# Altium project radxa_cm3_io_board_v1360_schematic.PrjPcb (part 1 of 5)
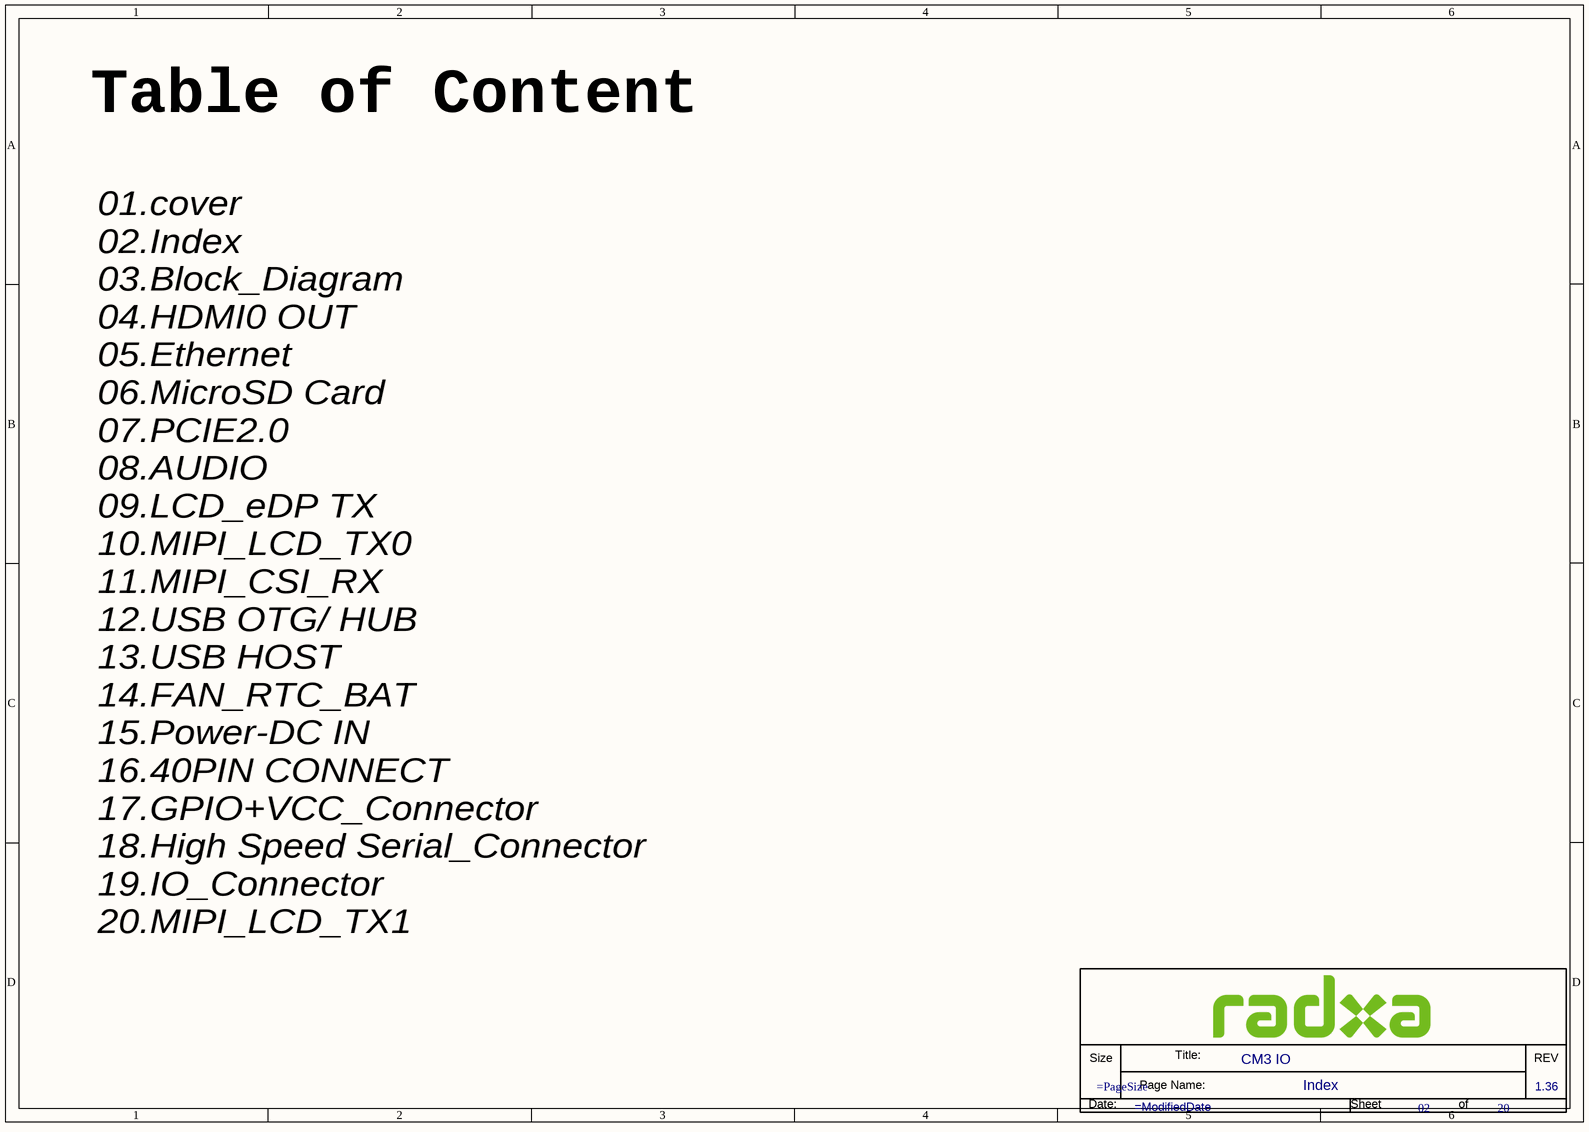
[diagram p0: 02.Index.SchDoc]
20 sheets, 532 parts. Net scope: global (net labels, ports and power ports of the same name join across sheets).
Sheets:
  01.cover.SchDoc
  02.Index.SchDoc
  03.Block_Diagram.SchDoc
  04.HDMI0 OUT.SchDoc
  05.Ethernet.SchDoc
  06.MicroSD Card.SchDoc
  07.PCIE2.0.SchDoc
  08.AUDIO.SchDoc
  09.LCD_eDP TX.SchDoc
  10.MIPI_LCD_TX0.SchDoc
  11.MIPI_CSI_RX.SchDoc
  12.USB OTG_ HUB.SchDoc
  13.USB HOST.SchDoc
  14.FAN_RTC_BAT.SchDoc
  15.Power-DC IN.SchDoc
  16.40PIN CONNECT.SchDoc
  17.GPIO+VCC_Connector.SchDoc
  18.High Speed Serial_Connector.SchDoc
  19.IO_Connector.SchDoc
  20.MIPI_LCD_TX1.SchDoc

## Sheet 01.cover.SchDoc
size 297 x 209 mm; DsnPath: D:\WMS\黄工\[RC119]CM3_IO_V1.36\对外资料\radxa_cm3_io_board_v1360.DSN; SchematicName: CM3_IO V1.36; PageName: 01.cover; PageSize: A4; TopSchematic: True

## Sheet 02.Index.SchDoc: CM3 IO
size 297 x 209 mm; Page Create Date: March  8, 1995; Page Number: 02; Page Size: A4; Comment: radxa_1010; Page Count: 20; RevCode: 1.36; Doc: Index; DsnPath: D:\WMS\黄工\[RC119]CM3_IO_V1.36\对外资料\radxa_cm3_io_board_v1360.DSN; SchematicName: CM3_IO V1.36; PageName: 02.Index; PageSize: A4; TopSchematic: True

### Parts
(Parts that share a designator on the sheet are numbered #1, #2 ... from top to bottom, then left to right.)
*#1  Doc: Index  RevCode: 1.36  Title: CM3 IO  Page Number: 02  Page Count: 20  (hidden comment: radxa_1010)  (graphical)

### Notes on the sheet
- Table of Content
- 01.cover
  02.Index
  03.Block_Diagram
  04.HDMI0 OUT
  05.Ethernet
  06.MicroSD Card
  07.PCIE2.0
  08.AUDIO
  09.LCD_eDP TX
  10.MIPI_LCD_TX0
  11.MIPI_CSI_RX
  12.USB OTG/ HUB
  13.USB HOST
  14.FAN_RTC_BAT
  15.Power-DC IN
  16.40PIN CONNECT
  17.GPIO+VCC_Connector
  18.High Speed Serial_Connector
  19.IO_Connector
  20.MIPI_LCD_TX1
- (in symbol radxa_1010) Title:; Size; REV; Page Name:; Date:; Sheet; of

### Library data of the parts
*#1 = radxa_1010: Page Create Date: March  8, 1995; Page Size: =PageSize; Page Modify Date: =ModifiedDate

## Sheet 03.Block_Diagram.SchDoc: CM3 IO
size 500 x 350 mm; Page Create Date: March  8, 1995; Page Number: 03; Page Size: Custom; Comment: radxa_1010; Page Count: 20; RevCode: 1.36; Doc: Block_Diagram; DsnPath: D:\WMS\黄工\[RC119]CM3_IO_V1.36\对外资料\radxa_cm3_io_board_v1360.DSN; SchematicName: CM3_IO V1.36; PageName: 03.Block_Diagram; PageSize: Custom; TopSchematic: True
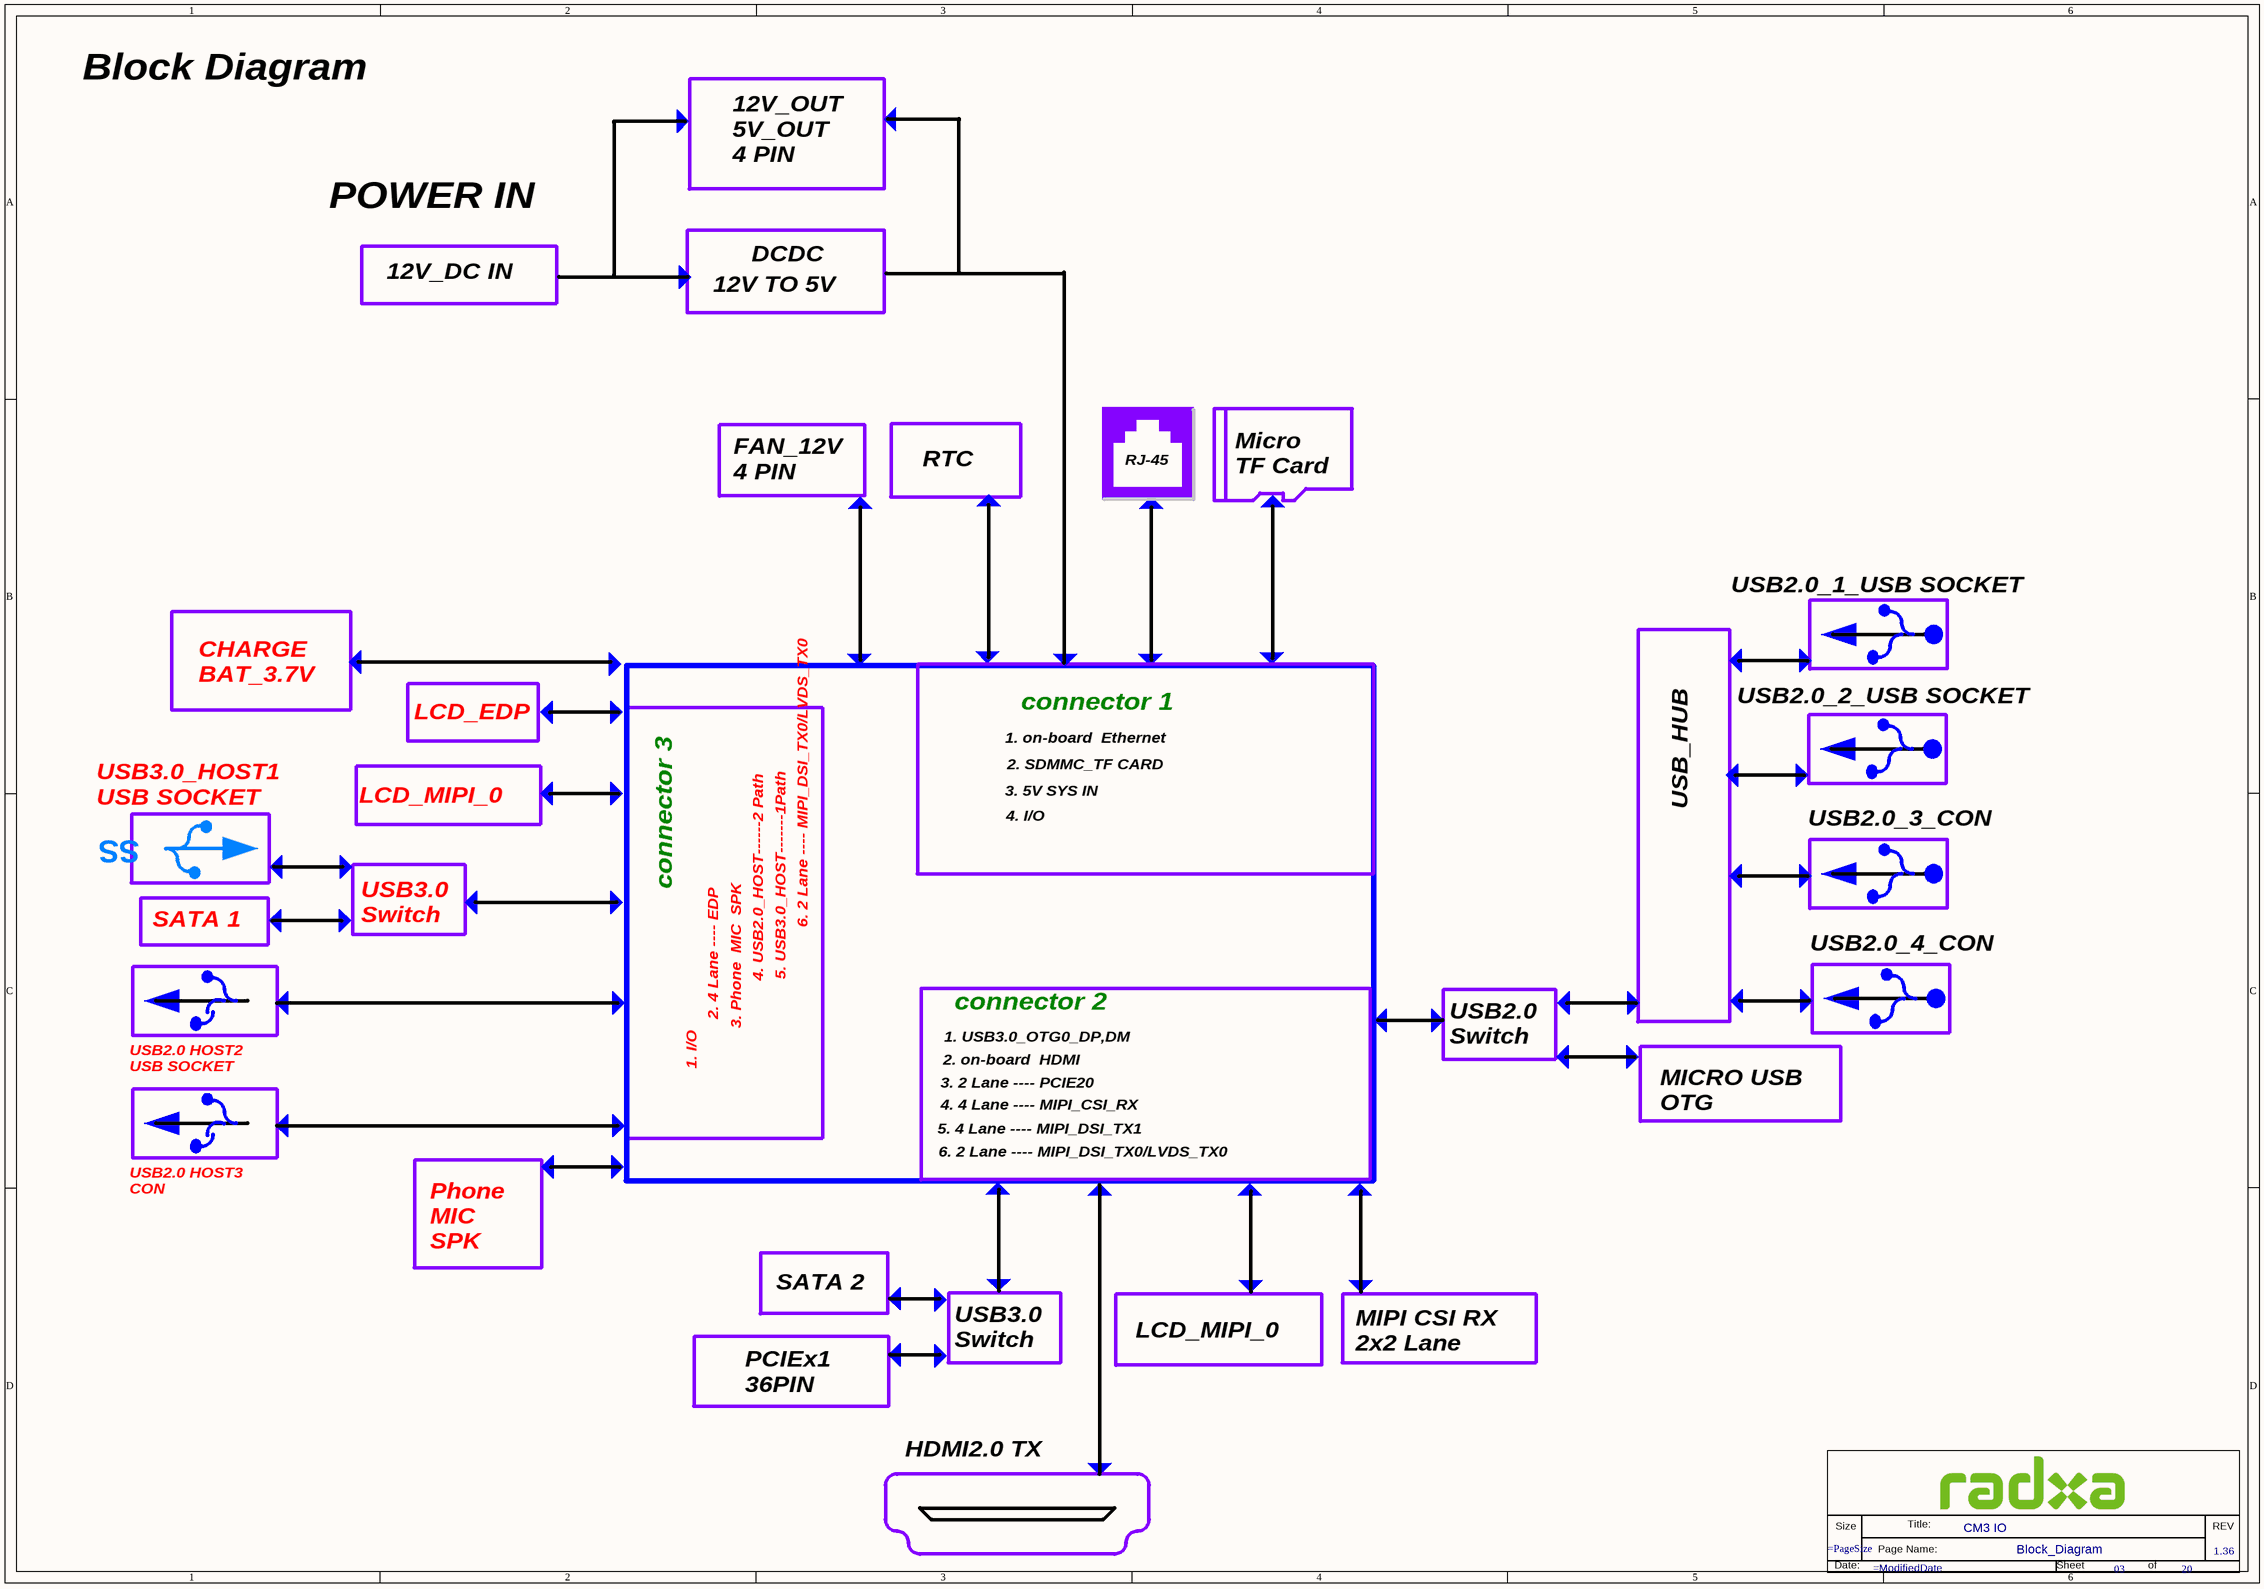
[diagram p1: 03.Block_Diagram.SchDoc]

### Parts
(Parts that share a designator on the sheet are numbered #1, #2 ... from top to bottom, then left to right.)
*#2  Doc: Block_Diagram  RevCode: 1.36  Title: CM3 IO  Page Number: 03  Page Count: 20  (hidden comment: radxa_1010)  (graphical)

### Notes on the sheet
- Block Diagram
- 12V_OUT
  5V_OUT
  4 PIN
- POWER IN
- 12V_DC IN
- DCDC
- 12V TO 5V
- FAN_12V
  4 PIN
- Micro
  TF Card
- RTC
- RJ-45
- CHARGE
  BAT_3.7V
- USB2.0_1_USB SOCKET
- LCD_EDP
- 1. on-board  Ethernet
- connector 1
- USB2.0_2_USB SOCKET
- USB3.0_HOST1
  USB SOCKET
- LCD_MIPI_0
- 3. 5V SYS IN
- 2. SDMMC_TF CARD
- USB_HUB
- SS
- 4. I/O
- USB2.0_3_CON
- USB3.0
  Switch
- connector 3
- SATA 1
- 5. USB3.0_HOST-------1Path
- 6. 2 Lane ---- MIPI_DSI_TX0/LVDS_TX0
- USB2.0_4_CON
- 2. 4 Lane ---- EDP
- 3. Phone  MIC  SPK
- 4. USB2.0_HOST------2 Path
- connector 2
- USB2.0
  Switch
- USB2.0 HOST2
  USB SOCKET
- 1. I/O
- 3. 2 Lane ---- PCIE20
- 2. on-board  HDMI
- 1. USB3.0_OTG0_DP,DM
- MICRO USB
  OTG
- 5. 4 Lane ---- MIPI_DSI_TX1
- 4. 4 Lane ---- MIPI_CSI_RX
- USB2.0 HOST3
  CON
- Phone
  MIC
  SPK
- SATA 2
- MIPI CSI RX
  2x2 Lane
- PCIEx1
  36PIN
- HDMI2.0 TX
- (in symbol radxa_1010) Size; Title:; REV; Page Name:; Date:; Sheet; of

### Library data of the parts
*#2 = radxa_1010: Page Create Date: March  8, 1995; Page Size: =PageSize; Page Modify Date: =ModifiedDate

## Sheet 04.HDMI0 OUT.SchDoc: CM3 IO
size 297 x 209 mm; Page Create Date: March  8, 1995; Page Number: 04; Page Size: A4; Comment: radxa_1010; Page Count: 20; RevCode: 1.36; Doc: HDMI0 OUT; DsnPath: D:\WMS\黄工\[RC119]CM3_IO_V1.36\对外资料\radxa_cm3_io_board_v1360.DSN; SchematicName: CM3_IO V1.36; PageName: 04.HDMI0 OUT; PageSize: A4; TopSchematic: True
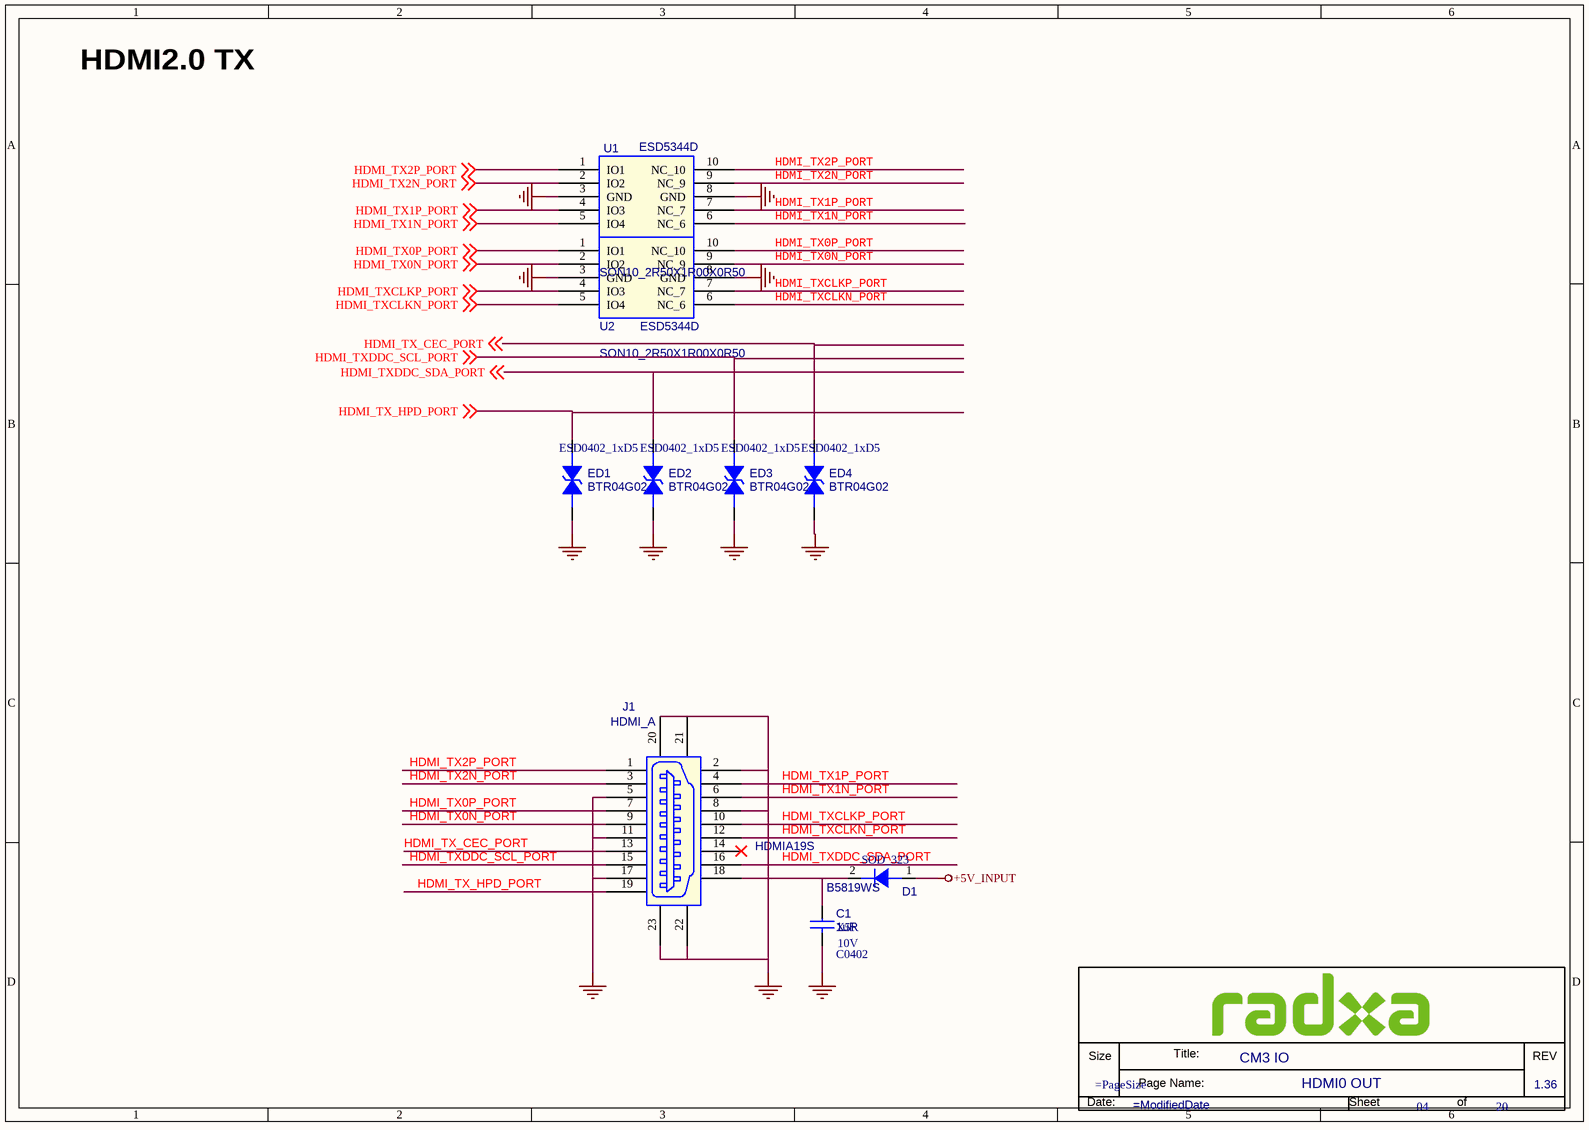
[diagram p2: 04.HDMI0 OUT.SchDoc]

### Parts
(Parts that share a designator on the sheet are numbered #1, #2 ... from top to bottom, then left to right.)
*#3  Doc: HDMI0 OUT  RevCode: 1.36  Title: CM3 IO  Page Number: 04  Page Count: 20  (hidden comment: radxa_1010)  (graphical)
C1  1uF  Voltage: 10V  Dielectric: X5R  [C0402]
D1  B5819WS  [SOD_323]
ED1  BTR04G02  [ESD0402_1xD5]
ED2  BTR04G02  [ESD0402_1xD5]
ED3  BTR04G02  [ESD0402_1xD5]
ED4  BTR04G02  [ESD0402_1xD5]
J1  HDMI_A  [HDMIA19S]
U1  ESD5344D  [SON10_2R50X1R00X0R50]
U2  ESD5344D  [SON10_2R50X1R00X0R50]

### Nets
+5V_INPUT: D1.1(A)
GND: C1.2 ED1.2 ED2.2 ED3.2 ED4.2 J1.2 J1.5 J1.8 J1.11 J1.17 J1.20 J1.21 J1.22 J1.23 U1.3(GND) U1.8(GND) U2.3(GND) U2.8(GND)
HDMI_TX0N_PORT: J1.9 U2.2(IO2) U2.9(NC_9) ; off-sheet HDMI_TX0N_PORT
HDMI_TX0P_PORT: J1.7 U2.1(IO1) U2.10(NC_10) ; off-sheet HDMI_TX0P_PORT
HDMI_TX1N_PORT: J1.6 U1.5(IO4) U1.6(NC_6) ; off-sheet HDMI_TX1N_PORT
HDMI_TX1P_PORT: J1.4 U1.4(IO3) U1.7(NC_7) ; off-sheet HDMI_TX1P_PORT
HDMI_TX2N_PORT: J1.3 U1.2(IO2) U1.9(NC_9) ; off-sheet HDMI_TX2N_PORT
HDMI_TX2P_PORT: J1.1($PIN0) U1.1(IO1) U1.10(NC_10) ; off-sheet HDMI_TX2P_PORT
HDMI_TX_CEC_PORT: ED4.1 J1.13 ; off-sheet HDMI_TX_CEC_PORT
HDMI_TX_HPD_PORT: ED1.1 J1.19 ; off-sheet HDMI_TX_HPD_PORT
HDMI_TXCLKN_PORT: J1.12 U2.5(IO4) U2.6(NC_6) ; off-sheet HDMI_TXCLKN_PORT
HDMI_TXCLKP_PORT: J1.10 U2.4(IO3) U2.7(NC_7) ; off-sheet HDMI_TXCLKP_PORT
HDMI_TXDDC_SCL_PORT: ED3.1 J1.15 ; off-sheet HDMI_TXDDC_SCL_PORT
HDMI_TXDDC_SDA_PORT: ED2.1 J1.16 ; off-sheet HDMI_TXDDC_SDA_PORT
NetC1_1: C1.1 D1.2(K) J1.18

Not connected (* = marked no-connect by the designer): J1 14*

### Notes on the sheet
- HDMI2.0 TX
- (in symbol radxa_1010) Title:; Size; REV; Page Name:; Date:; Sheet; of

### Library data of the parts
C1 = CAP NP_0: cap,1.00uF,+/-10%,10V,X5R,C0402; Part Reference: C1; Manufacturer: TDK; RK PN: C1005X5R1A105K050BB; Priority: A; Tolerance: 10%; PCB Footprint: C0402; Value: 1uF; Part Type: C0402; Manufacturer PN: C1005X5R1A105K050BB; Created by: JJJ
D1 = DIODE: Schottky Barrier，B5819WS SOD-323; Part Reference: D1; Manufacturer: 长电; Priority: A; PCB Footprint: SOD_323; Value: B5819WS; Created by: JJJ; Manufacturer PN: B5819WS; Part Type: Schottky rectifier; RK PN: B5819WS
ED1 = DIODE BI_DIR TRIG_0: 1-Line, Bi-directional, Transient Voltage Suppressors.17.5pF.; Part Reference: ED1; Manufacturer PN: ESD5451N; Manufacturer: WillSemi(韦尔半导体); Priority: A; PCB Footprint: ESD0402_1xD5; Value: BTR04G02; Created by: JJJ; Part Type: ESD_TVS; RK PN: ESD5451N
ED2 = DIODE BI_DIR TRIG_0: 1-Line, Bi-directional, Transient Voltage Suppressors.17.5pF.; Part Reference: ED2; Manufacturer: WillSemi(韦尔半导体); RK PN: ESD5451N; Priority: A; PCB Footprint: ESD0402_1xD5; Value: BTR04G02; Part Type: ESD_TVS; Manufacturer PN: ESD5451N; Created by: JJJ
ED3 = DIODE BI_DIR TRIG_0: 1-Line, Bi-directional, Transient Voltage Suppressors.17.5pF.; Part Reference: ED3; Manufacturer: WillSemi(韦尔半导体); RK PN: ESD5451N; Priority: A; PCB Footprint: ESD0402_1xD5; Value: BTR04G02; Part Type: ESD_TVS; Manufacturer PN: ESD5451N; Created by: JJJ
ED4 = DIODE BI_DIR TRIG_0: 1-Line, Bi-directional, Transient Voltage Suppressors.17.5pF.; Part Reference: ED4; Manufacturer: WillSemi(韦尔半导体); RK PN: ESD5451N; Priority: A; PCB Footprint: ESD0402_1xD5; Value: BTR04G02; Part Type: ESD_TVS; Manufacturer PN: ESD5451N; Created by: JJJ
J1 = HDMI_A: 通用A型HDMI座,卧式,侧插; Part Reference: J1; Manufacturer: 旺科达; Priority: A; PCB Footprint: HDMIA19S; Value: HDMI_A; RK PN: HDMI_A; Part Type: HDMI Jack; Manufacturer Part Number: HDMI_A; Created by: JJJ
U1 = ESD_ESD5304D: 4-Lines, Uni-directional, Ultra-low Capacitance Transient Voltage Suppressors; Part Reference: U1; Manufacturer: WillSemi(韦尔半导体); Priority: A; PCB Footprint: SON10_2R50X1R00X0R50; Value: ESD5344D; RK PN: ESD5304D; Part Type: ESD_TVS; Manufacturer PN: ESD5304D; Created by: JJJ
U2 = ESD_ESD5304D: 4-Lines, Uni-directional, Ultra-low Capacitance Transient Voltage Suppressors; Part Reference: U2; Manufacturer: WillSemi(韦尔半导体); Priority: A; PCB Footprint: SON10_2R50X1R00X0R50; Value: ESD5344D; Created by: JJJ; Manufacturer PN: ESD5304D; Part Type: ESD_TVS; RK PN: ESD5304D
*#3 = radxa_1010: Page Create Date: March  8, 1995; Page Size: =PageSize; Page Modify Date: =ModifiedDate

## Sheet 05.Ethernet.SchDoc: CM3 IO
size 297 x 209 mm; Page Create Date: March  8, 1995; Page Number: 05; Page Size: A4; Comment: radxa_1010; Page Count: 20; RevCode: 1.36; Doc: Ethernet; DsnPath: D:\WMS\黄工\[RC119]CM3_IO_V1.36\对外资料\radxa_cm3_io_board_v1360.DSN; SchematicName: CM3_IO V1.36; PageName: 05.Ethernet; PageSize: A4; TopSchematic: True
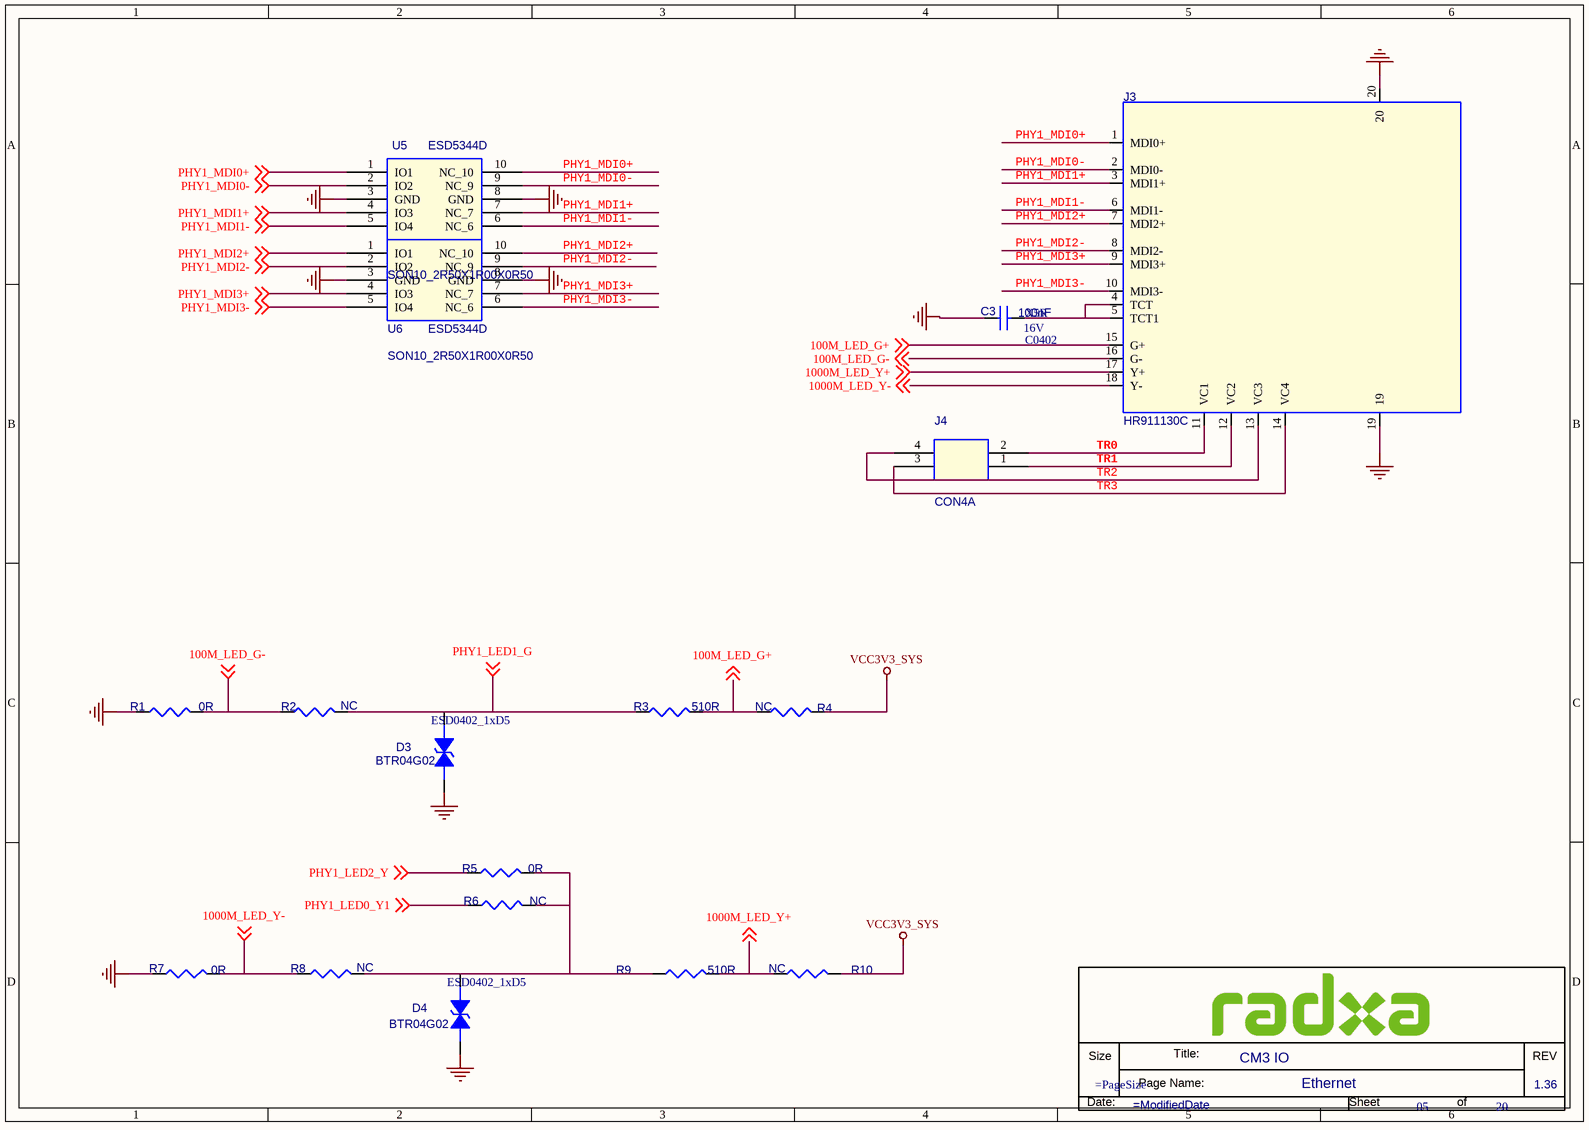
[diagram p3: 05.Ethernet.SchDoc]

### Parts
(Parts that share a designator on the sheet are numbered #1, #2 ... from top to bottom, then left to right.)
*#4  Doc: Ethernet  RevCode: 1.36  Title: CM3 IO  Page Number: 05  Page Count: 20  (hidden comment: radxa_1010)  (graphical)
C3  100nF  Voltage: 16V  Dielectric: X5R  [C0402]
D3  BTR04G02  [ESD0402_1xD5]
D4  BTR04G02  [ESD0402_1xD5]
J3  HR911130C  [RJ45_PULSE]
J4  CON4A  [DIP4PIN-2_54MM-2X2]
R1  0R  [R0402]
R2  NC  [R0402]
R3  510R  [R0402]
R4  NC  [R0402]
R5  0R  [R0402]
R6  NC  [R0402]
R7  0R  [R0402]
R8  NC  [R0402]
R9  510R  [R0402]
R10  NC  [R0402]
U5  ESD5344D  [SON10_2R50X1R00X0R50]
U6  ESD5344D  [SON10_2R50X1R00X0R50]

### Nets
GND: C3.1 D3.1 D4.1 J3.19 J3.20 R1.1 R7.1 U5.3(GND) U5.8(GND) U6.3(GND) U6.8(GND)
VCC3V3_SYS: R4.2 R10.2
100M_LED_G+: J3.15(G+) R3.2 R4.1 ; off-sheet 100M_LED_G+
100M_LED_G-: J3.16(G-) R1.2 R2.1 ; off-sheet 100M_LED_G-
1000M_LED_Y+: J3.17(Y+) R9.2 R10.1 ; off-sheet 1000M_LED_Y+
1000M_LED_Y-: J3.18(Y-) R7.2 R8.1 ; off-sheet 1000M_LED_Y-
PHY1_LED0_Y1: R6.1 ; off-sheet PHY1_LED0_Y1
PHY1_LED1_G: D3.2 R2.2 R3.1 ; off-sheet PHY1_LED1_G
PHY1_LED2_Y: R5.1 ; off-sheet PHY1_LED2_Y
PHY1_MDI0+: J3.1(MDI0+) U5.1(IO1) U5.10(NC_10) ; off-sheet PHY1_MDI0+
PHY1_MDI0-: J3.2(MDI0-) U5.2(IO2) U5.9(NC_9) ; off-sheet PHY1_MDI0-
PHY1_MDI1+: J3.3(MDI1+) U5.4(IO3) U5.7(NC_7) ; off-sheet PHY1_MDI1+
PHY1_MDI1-: J3.6(MDI1-) U5.5(IO4) U5.6(NC_6) ; off-sheet PHY1_MDI1-
PHY1_MDI2+: J3.7(MDI2+) U6.1(IO1) U6.10(NC_10) ; off-sheet PHY1_MDI2+
PHY1_MDI2-: J3.8(MDI2-) U6.2(IO2) U6.9(NC_9) ; off-sheet PHY1_MDI2-
PHY1_MDI3+: J3.9(MDI3+) U6.4(IO3) U6.7(NC_7) ; off-sheet PHY1_MDI3+
PHY1_MDI3-: J3.10(MDI3-) U6.5(IO4) U6.6(NC_6) ; off-sheet PHY1_MDI3-
TR0: J3.11(VC1) J4.2
TR1: J3.12(VC2) J4.1
TR2: J3.13(VC3) J4.4
TR3: J3.14(VC4) J4.3
NetC3_2: C3.2 J3.4(TCT) J3.5(TCT1)
NetD4_2: D4.2 R5.2 R6.2 R8.2 R9.1

### Notes on the sheet
- (in symbol radxa_1010) Title:; Size; REV; Page Name:; Date:; Sheet; of

### Library data of the parts
C3 = CAP NP_0: cap,100.00nF,+/-10%,16V,X5R,C0402; Part Reference: C3; Manufacturer PN: C1005X5R1C104K050BA; Manufacturer: TDK; Tolerance: 10%; Priority: A; PCB Footprint: C0402; Value: 100nF; Created by: JJJ; Part Type: C0402; RK PN: C1005X5R1C104K050BA
D3 = DIODE BI_DIR TRIG_0: 1-Line, Bi-directional, Transient Voltage Suppressors.17.5pF.; Part Reference: D3; Manufacturer PN: ESD5451N; Manufacturer: WillSemi(韦尔半导体); OPTION: DNP; Priority: A; PCB Footprint: ESD0402_1xD5; Value: BTR04G02; Created by: JJJ; Part Type: ESD_TVS; RK PN: ESD5451N
D4 = DIODE BI_DIR TRIG_0: 1-Line, Bi-directional, Transient Voltage Suppressors.17.5pF.; Part Reference: D4; Manufacturer: WillSemi(韦尔半导体); RK PN: ESD5451N; Priority: A; OPTION: DNP; PCB Footprint: ESD0402_1xD5; Value: BTR04G02; Part Type: ESD_TVS; Manufacturer PN: ESD5451N; Created by: JJJ
J3 = HR911130C_1: 千兆网口接口，内置变压器; Part Reference: J3; VAL: J00-0061; DESIG: 10/100 base TX LXT971A; BOI: RJ45; FAB: PULSE; DEV: CON_PULSE_J00-61; Priority: A; PCB Footprint: RJ45_HRK1; REF: J00-0061; Value: HR911130C; Created by: JJJ; Manufacturer Part Number: HR911130C; Part Type: Ethernet Jack; RK PN: HR911130C
J4 = CON4A_0: Part Reference: J4; Value: CON4A; PCB Footprint: DIP4PIN-2_54MM-2X2
R1 = RESISTOR_0: 通用厚膜电阻,0R,+/-5%,R0402,1/16W.; Part Reference: R1; Manufacturer: YAGEO; RK PN: RC0402JR-070RL; Priority: A; Tolerance: 5%; Wattage: 1/16W; Value: 0R; Part Type: 通用厚膜电阻; Manufacturer PN: RC0402JR-070RL; Created by: YTL; PCB Footprint: R0402
R2 = RESISTOR_0: 通用厚膜电阻,0R,+/-5%,R0402,1/16W.; Part Reference: R2; Manufacturer PN: RC0402JR-070RL; Manufacturer: YAGEO; Wattage: 1/16W; Tolerance: 5%; Priority: A; Value: NC; Created by: YTL; Part Type: 通用厚膜电阻; RK PN: RC0402JR-070RL; PCB Footprint: R0402
R3 = RESISTOR_0: 通用厚膜电阻,0R,+/-5%,R0402,1/16W.; Part Reference: R3; Manufacturer: YAGEO; RK PN: RC0402JR-070RL; Priority: A; Tolerance: 5%; Wattage: 1/16W; option: DNP; Value: 510R; Part Type: 通用厚膜电阻; Manufacturer PN: RC0402JR-070RL; Created by: YTL; PCB Footprint: R0402
R4 = RESISTOR_0: 通用厚膜电阻,510R,+/-5%,R0402,1/16W.; Part Reference: R4; Manufacturer PN: RC0402JR-07510RL; Manufacturer: YAGEO; Wattage: 1/16W; Tolerance: 5%; Priority: A; Value: NC; Created by: YTL; Part Type: 通用厚膜电阻; RK PN: RC0402JR-07510RL; PCB Footprint: R0402
R5 = RESISTOR_0: 通用厚膜电阻,0R,+/-5%,R0402,1/16W.; Part Reference: R5; Manufacturer PN: RC0402JR-070RL; Manufacturer: YAGEO; Wattage: 1/16W; Tolerance: 5%; Priority: A; Value: 0R; Created by: YTL; Part Type: 通用厚膜电阻; RK PN: RC0402JR-070RL; PCB Footprint: R0402
R6 = RESISTOR_0: 通用厚膜电阻,0R,+/-5%,R0402,1/16W.; Part Reference: R6; Manufacturer PN: RC0402JR-070RL; Manufacturer: YAGEO; Wattage: 1/16W; Tolerance: 5%; Priority: A; Value: NC; Created by: YTL; Part Type: 通用厚膜电阻; RK PN: RC0402JR-070RL; PCB Footprint: R0402
R7 = RESISTOR_0: 通用厚膜电阻,0R,+/-5%,R0402,1/16W.; Part Reference: R7; Manufacturer PN: RC0402JR-070RL; Manufacturer: YAGEO; Wattage: 1/16W; Tolerance: 5%; Priority: A; Value: 0R; Created by: YTL; Part Type: 通用厚膜电阻; RK PN: RC0402JR-070RL; PCB Footprint: R0402
R8 = RESISTOR_0: 通用厚膜电阻,0R,+/-5%,R0402,1/16W.; Part Reference: R8; Manufacturer PN: RC0402JR-070RL; Manufacturer: YAGEO; Wattage: 1/16W; Tolerance: 5%; Priority: A; Value: NC; Created by: YTL; Part Type: 通用厚膜电阻; RK PN: RC0402JR-070RL; PCB Footprint: R0402
R9 = RESISTOR_0: 通用厚膜电阻,0R,+/-5%,R0402,1/16W.; Part Reference: R9; Manufacturer PN: RC0402JR-070RL; Manufacturer: YAGEO; option: DNP; Wattage: 1/16W; Tolerance: 5%; Priority: A; Value: 510R; Created by: YTL; Part Type: 通用厚膜电阻; RK PN: RC0402JR-070RL; PCB Footprint: R0402
R10 = RESISTOR_0: 通用厚膜电阻,510R,+/-5%,R0402,1/16W.; Part Reference: R10; Manufacturer: YAGEO; RK PN: RC0402JR-07510RL; Priority: A; Tolerance: 5%; Wattage: 1/16W; Value: NC; Part Type: 通用厚膜电阻; Manufacturer PN: RC0402JR-07510RL; Created by: YTL; PCB Footprint: R0402
U5 = ESD_ESD5304D: 4-Lines, Uni-directional, Ultra-low Capacitance Transient Voltage Suppressors; Part Reference: U5; Manufacturer: WillSemi(韦尔半导体); Priority: A; PCB Footprint: SON10_2R50X1R00X0R50; Value: ESD5344D; Created by: JJJ; Manufacturer PN: ESD5304D; Part Type: ESD_TVS; RK PN: ESD5304D
U6 = ESD_ESD5304D: 4-Lines, Uni-directional, Ultra-low Capacitance Transient Voltage Suppressors; Part Reference: U6; Manufacturer: WillSemi(韦尔半导体); Priority: A; PCB Footprint: SON10_2R50X1R00X0R50; Value: ESD5344D; RK PN: ESD5304D; Part Type: ESD_TVS; Manufacturer PN: ESD5304D; Created by: JJJ
*#4 = radxa_1010: Page Create Date: March  8, 1995; Page Size: =PageSize; Page Modify Date: =ModifiedDate

## Sheet 06.MicroSD Card.SchDoc: CM3 IO
size 297 x 209 mm; Page Create Date: March  8, 1995; Page Number: 06; Page Size: A4; Comment: radxa_1010; Page Count: 20; RevCode: 1.36; Doc: MicroSD Card; DsnPath: D:\WMS\黄工\[RC119]CM3_IO_V1.36\对外资料\radxa_cm3_io_board_v1360.DSN; SchematicName: CM3_IO V1.36; PageName: 06.MicroSD Card; PageSize: A4; TopSchematic: True
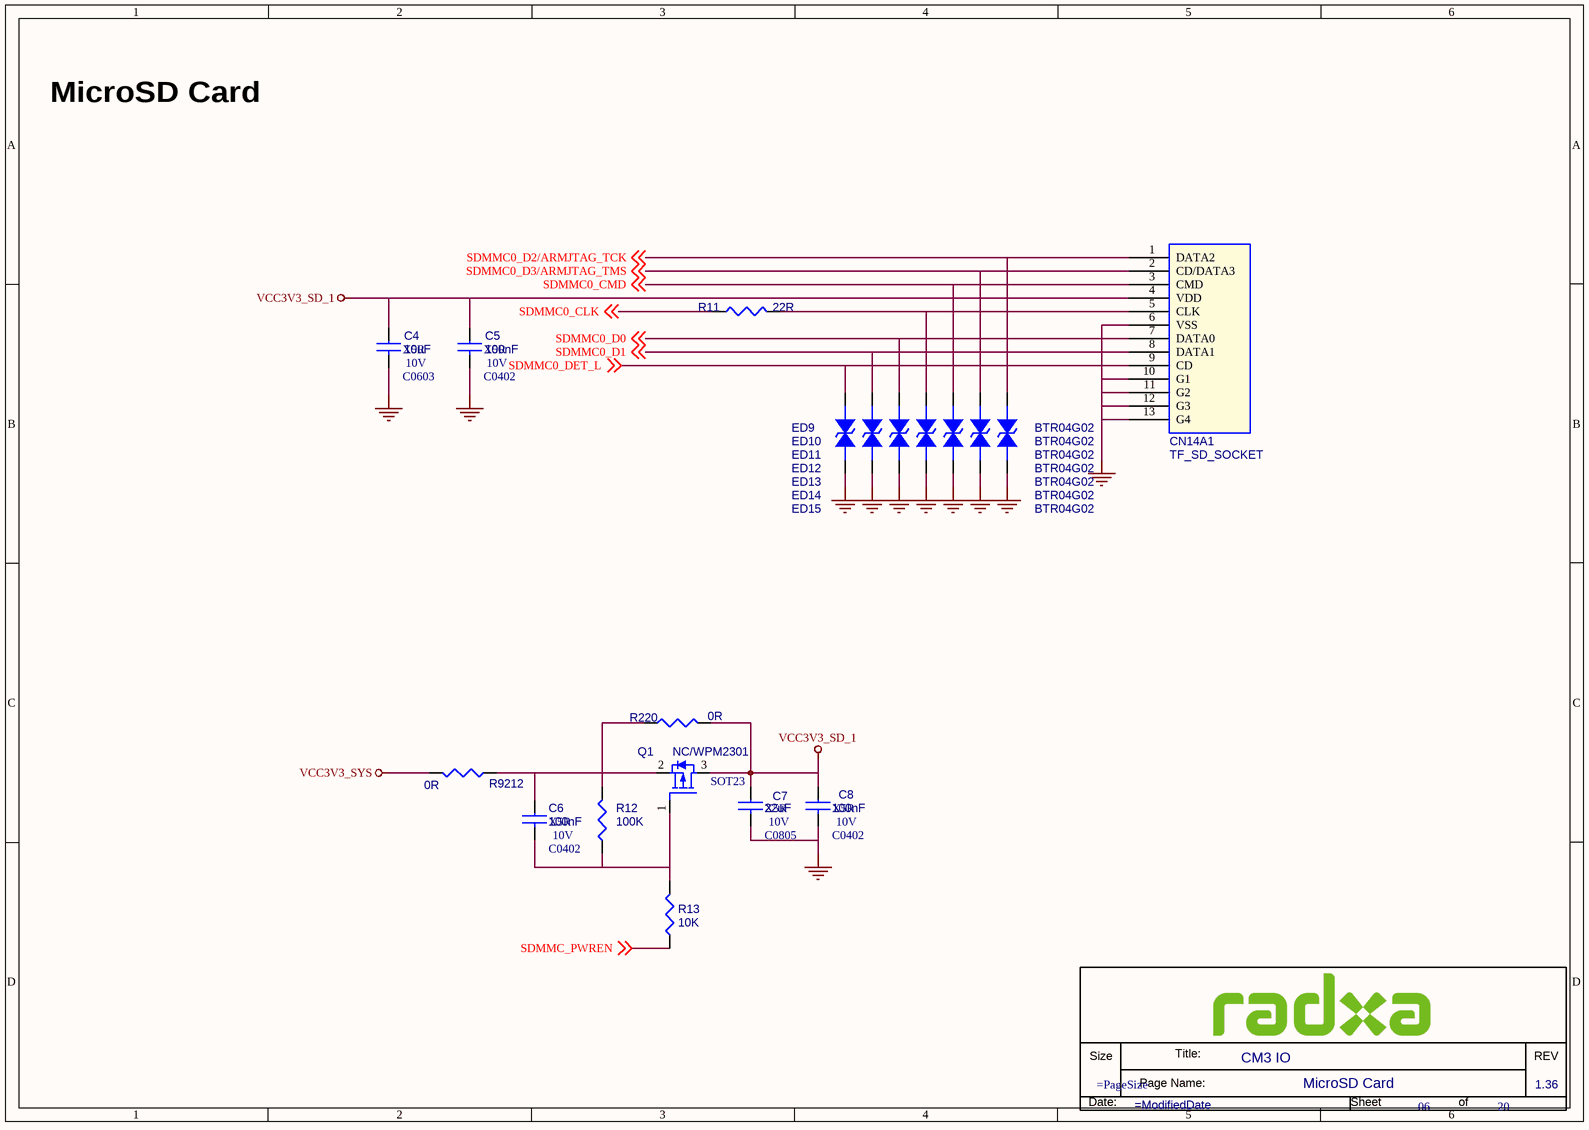
[diagram p4: 06.MicroSD Card.SchDoc]

### Parts
(Parts that share a designator on the sheet are numbered #1, #2 ... from top to bottom, then left to right.)
*#5  Doc: MicroSD Card  RevCode: 1.36  Title: CM3 IO  Page Number: 06  Page Count: 20  (hidden comment: radxa_1010)  (graphical)
C4  10uF  Voltage: 10V  Dielectric: X5R  [C0603]
C5  100nF  Voltage: 10V  Dielectric: X5R  [C0402]
C6  100nF  Voltage: 10V  Dielectric: X5R  [C0402]
C7  22uF  Voltage: 10V  Dielectric: X5R  [C0805]
C8  100nF  Voltage: 10V  Dielectric: X5R  [C0402]
CN14A1  TF_SD_SOCKET  [TF-CKT01-009D]
ED9  BTR04G02  [ESD0402_1xD5]
ED10  BTR04G02  [ESD0402_1xD5]
ED11  BTR04G02  [ESD0402_1xD5]
ED12  BTR04G02  [ESD0402_1xD5]
ED13  BTR04G02  [ESD0402_1xD5]
ED14  BTR04G02  [ESD0402_1xD5]
ED15  BTR04G02  [ESD0402_1xD5]
Q1  NC/WPM2301  [SOT23]
R11  22R  [R0402]
R12  100K  [R0402]
R13  10K  [R0402]
R220  0R  [R0402]
R9212  0R  [R0603]

### Nets
GND: C4.2 C5.2 C7.2 C8.2 CN14A1.6(VSS) CN14A1.10(G1) CN14A1.11(G2) CN14A1.12(G3) CN14A1.13(G4) ED9.2 ED10.2 ED11.2 ED12.2 ED13.2 ED14.2 ED15.2
VCC3V3_SD_1: C4.1 C5.1 C7.1 C8.1 CN14A1.4(VDD) Q1.3(DRAIN) R220.2
VCC3V3_SYS: R9212.2
SDMMC0_CLK: R11.1 ; off-sheet SDMMC0_CLK
SDMMC0_CMD: CN14A1.3(CMD) ED13.1 ; off-sheet SDMMC0_CMD
SDMMC0_D0: CN14A1.7(DATA0) ED11.1 ; off-sheet SDMMC0_D0
SDMMC0_D1: CN14A1.8(DATA1) ED10.1 ; off-sheet SDMMC0_D1
SDMMC0_D2/ARMJTAG_TCK: CN14A1.1(DATA2) ED15.1 ; off-sheet SDMMC0_D2/ARMJTAG_TCK
SDMMC0_D3/ARMJTAG_TMS: CN14A1.2(CD/DATA3) ED14.1 ; off-sheet SDMMC0_D3/ARMJTAG_TMS
SDMMC0_DET_L: CN14A1.9(CD) ED9.1 ; off-sheet SDMMC0_DET_L
SDMMC_PWREN: R13.2 ; off-sheet SDMMC_PWREN
NetC6_1: C6.1 Q1.2(SOURCE) R12.1 R220.1 R9212.1
NetC6_2: C6.2 Q1.1(GATE) R12.2 R13.1
NetCN14A1_5: CN14A1.5(CLK) ED12.1 R11.2

### Notes on the sheet
- MicroSD Card
- (in symbol radxa_1010) Title:; Size; REV; Page Name:; Date:; Sheet; of

### Library data of the parts
C4 = CAP NP_0: cap,10.00uF,+/-10%,10V,X5R,C0603; Part Reference: C4; Manufacturer: TDK; RK PN: C1608X5R1A106K080AC; Priority: A; C_Voltage: 6.3V; Tolerance: 10%; PCB Footprint: C0603; Value: 10uF; Part Type: C0603; Manufacturer PN: C1608X5R1A106K080AC; Created by: JJJ
C5 = CAP NP_0: cap,100.00nF,+/-10%,10V,X5R,C0402; Part Reference: C5; Manufacturer: TDK; RK PN: C1005X5R1A104K050BA; Priority: A; Tolerance: 10%; C_Voltage: 6.3V; PCB Footprint: C0402; Value: 100nF; Part Type: C0402; Manufacturer PN: C1005X5R1A104K050BA; Created by: JJJ
C6 = CAP NP_0: cap,100.00nF,+/-10%,16V,X5R,C0402; Part Reference: C6; Manufacturer: TDK; RK PN: C1005X5R1C104K050BA; Priority: A; Tolerance: 10%; PCB Footprint: C0402; Value: 100nF; Part Type: C0402; Manufacturer PN: C1005X5R1C104K050BA; Created by: JJJ
C7 = CAP NP_0: cap,10.00uF,+/-10%,6.3V,X5R,C0603; Part Reference: C7; Manufacturer PN: C1608X5R0J106K080AB; Manufacturer: TDK; Tolerance: 10%; Priority: A; PCB Footprint: C0805; Value: 22uF; Created by: JJJ; Part Type: C0603; RK PN: C1608X5R0J106K080AB
C8 = CAP NP_0: cap,100.00nF,+/-10%,16V,X5R,C0402; Part Reference: C8; Manufacturer PN: C1005X5R1C104K050BA; Manufacturer: TDK; Tolerance: 10%; Priority: A; PCB Footprint: C0402; Value: 100nF; Created by: JJJ; Part Type: C0402; RK PN: C1005X5R1C104K050BA
CN14A1 = SD_SOCKET_0: Part Reference: CN14A1; Value: TF_SD_SOCKET; PCB Footprint: TF-CKT01-009D
ED9 = DIODE BI-DIR TRIG: ESD; Part Reference: ED9; Value: BTR04G02; PCB Footprint: ESD0402_1xD5
ED10 = DIODE BI-DIR TRIG: ESD; Part Reference: ED10; Value: BTR04G02; PCB Footprint: ESD0402_1xD5
ED11 = DIODE BI-DIR TRIG: ESD; Part Reference: ED11; Value: BTR04G02; PCB Footprint: ESD0402_1xD5
ED12 = DIODE BI-DIR TRIG: ESD; Part Reference: ED12; Value: BTR04G02; PCB Footprint: ESD0402_1xD5
ED13 = DIODE BI-DIR TRIG: ESD; Part Reference: ED13; Value: BTR04G02; PCB Footprint: ESD0402_1xD5
ED14 = DIODE BI-DIR TRIG: ESD; Part Reference: ED14; Value: BTR04G02; PCB Footprint: ESD0402_1xD5
ED15 = DIODE BI-DIR TRIG: ESD; Part Reference: ED15; Value: BTR04G02; PCB Footprint: ESD0402_1xD5
Q1 = MOSFET P: PMOS,WPM3407-3/TR,SOT_23,Id=4.4A,Vds=30V; Part Reference: Q1; Manufacturer: WillSemi(韦尔半导体); Priority: A; Id_max: 4.4A; Vgs: ±20V; VDS: 30V; Vgsth: 2.0V; Pd: 0.9W; PCB Footprint: SOT23; Value: NC/WPM2301; RK PN: WPM3407-3/TR; Part Type: PMOS; Manufacturer PN: WPM3407-3/TR; Created by: JJJ
R11 = RESISTOR_1: Part Reference: R11; Value: 22R; PCB Footprint: R0402
R12 = RESISTOR_0: 通用厚膜电阻,100K,+/-5%,R0402,1/16W.; Part Reference: R12; Manufacturer: YAGEO; RK PN: RC0402JR-07100KL; Priority: A; Tolerance: 5%; Wattage: 1/16W; Value: 100K; Part Type: 通用厚膜电阻; Manufacturer PN: RC0402JR-07100KL; Created by: YTL; PCB Footprint: R0402
R13 = RESISTOR_0: 通用厚膜电阻,10K,+/-5%,R0402,1/16W.; Part Reference: R13; Manufacturer PN: RC0402JR-0710KL; Manufacturer: YAGEO; Wattage: 1/16W; Tolerance: 5%; Priority: A; Value: 10K; Created by: YTL; Part Type: 通用厚膜电阻; RK PN: RC0402JR-0710KL; PCB Footprint: R0402
R220 = RESISTOR_0: 通用厚膜电阻,0R,+/-5%,R0402,1/16W.; Part Reference: R220; Manufacturer: YAGEO; RK PN: RC0402JR-070RL; Priority: A; Tolerance: 5%; Wattage: 1/16W; Value: 0R; Part Type: 通用厚膜电阻; Manufacturer PN: RC0402JR-070RL; Created by: YTL; PCB Footprint: R0402
R9212 = RESISTOR_0: 通用厚膜电阻,100R,+/-5%,R0402,1/16W.; Part Reference: R9212; Manufacturer: YAGEO; RK PN: RC0402JR-07100RL; Priority: A; Tolerance: 5%; Wattage: 1/16W; Value: 0R; Part Type: 通用厚膜电阻; Manufacturer PN: RC0402JR-07100RL; Created by: YTL; PCB Footprint: R0603
*#5 = radxa_1010: Page Create Date: March  8, 1995; Page Size: =PageSize; Page Modify Date: =ModifiedDate

## Sheet 07.PCIE2.0.SchDoc: CM3 IO
size 386 x 246 mm; Page Create Date: March  8, 1995; Page Number: 07; Page Size: B; Comment: radxa_1010; Page Count: 20; RevCode: 1.36; Doc: PCIE2.0; DsnPath: D:\WMS\黄工\[RC119]CM3_IO_V1.36\对外资料\radxa_cm3_io_board_v1360.DSN; SchematicName: CM3_IO V1.36; PageName: 07.PCIE2.0; PageSize: B; TopSchematic: True
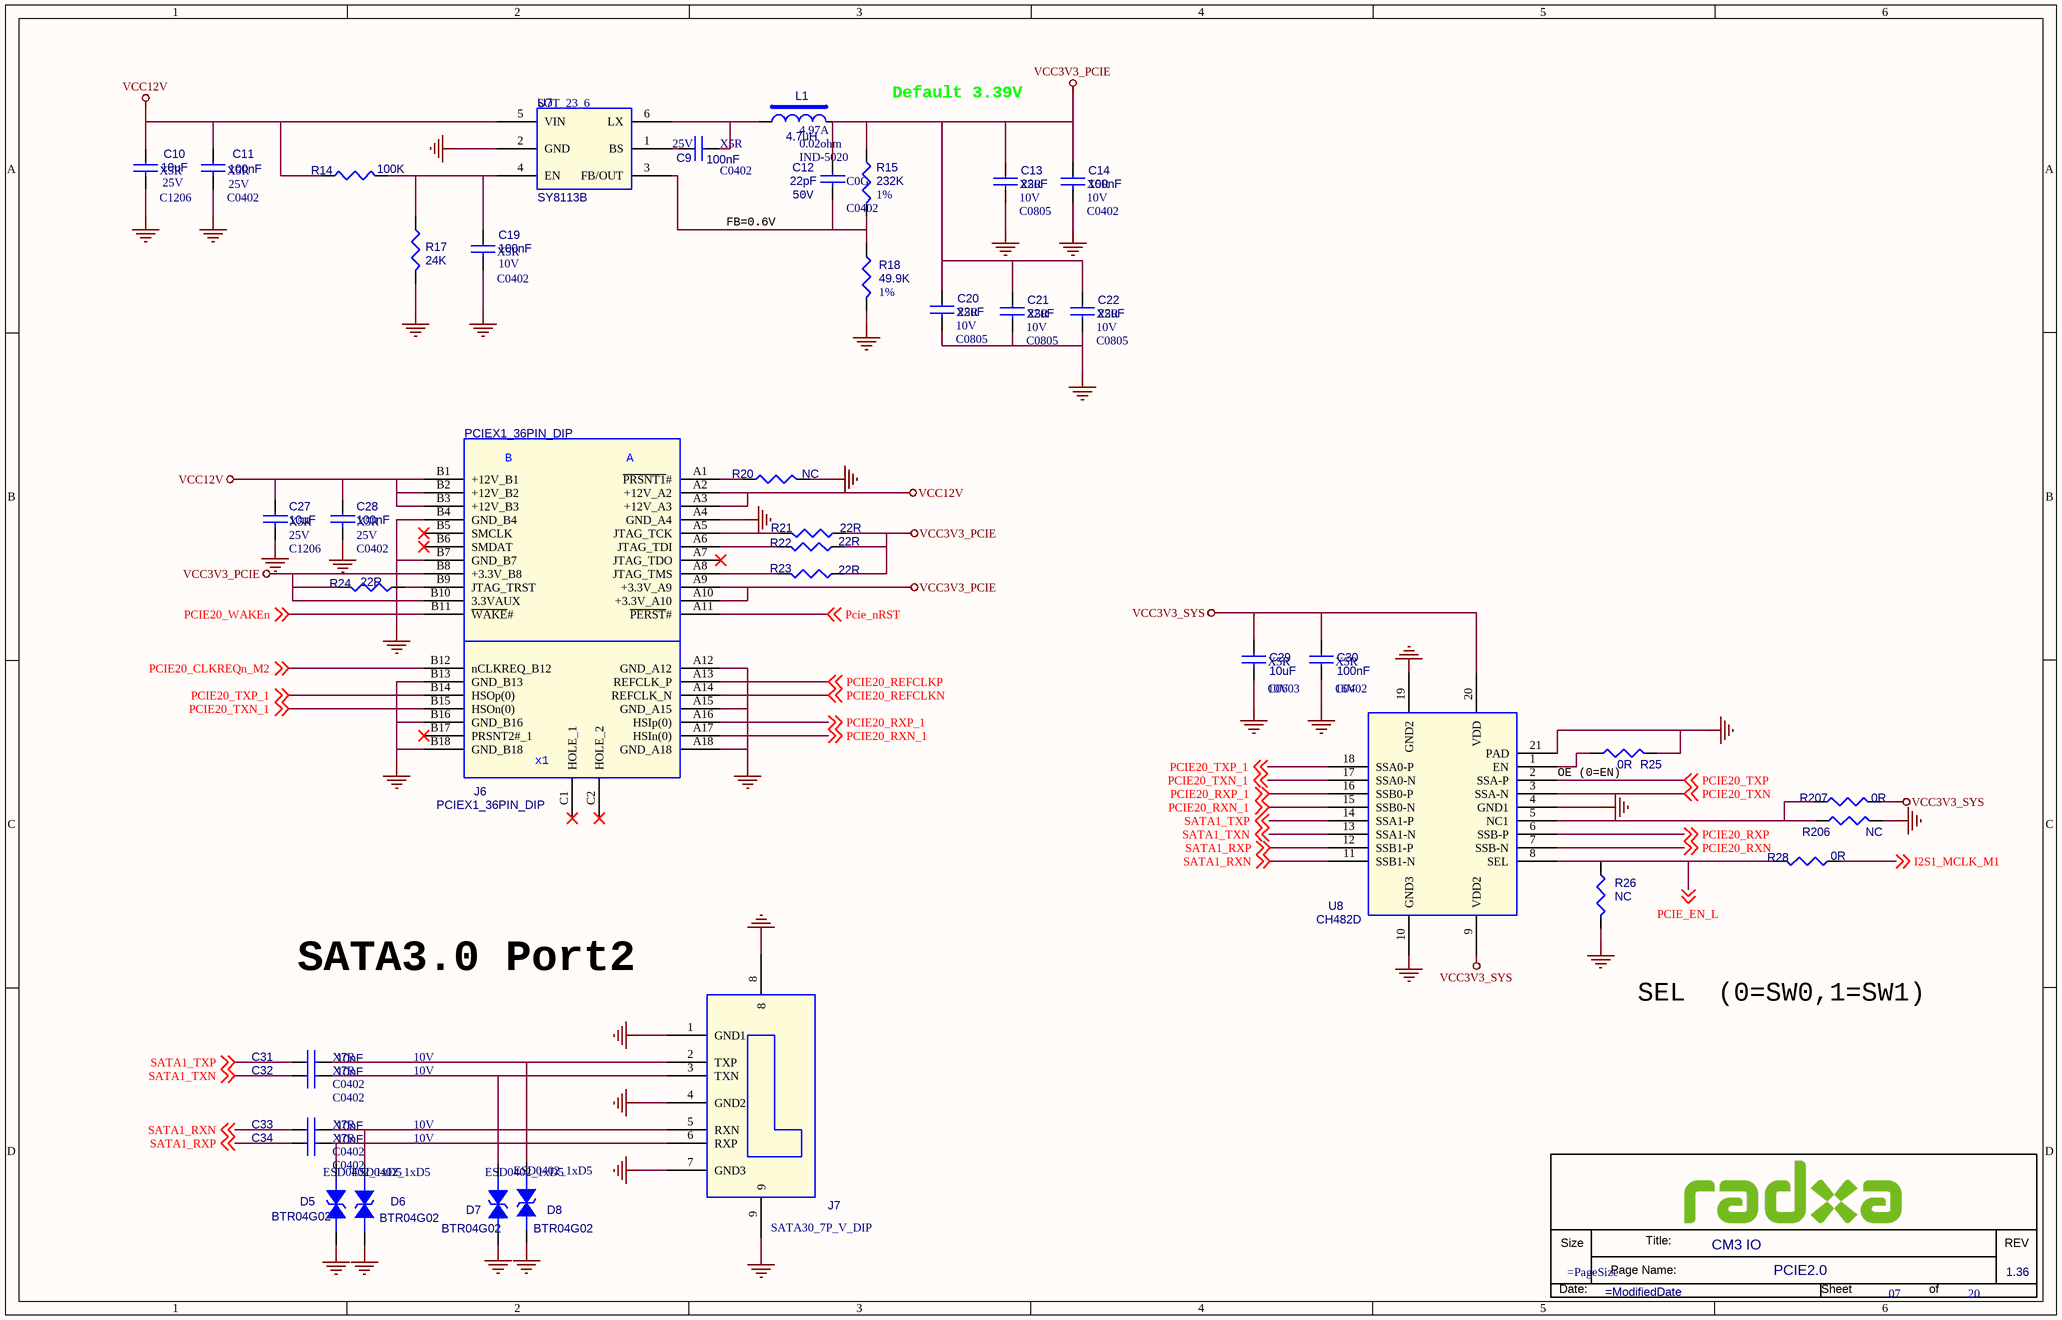
[diagram p5: 07.PCIE2.0.SchDoc]

### Parts
(Parts that share a designator on the sheet are numbered #1, #2 ... from top to bottom, then left to right.)
*#6  Doc: PCIE2.0  RevCode: 1.36  Title: CM3 IO  Page Number: 07  Page Count: 20  (hidden comment: radxa_1010)  (graphical)
C9  100nF  Voltage: 25V  Dielectric: X5R  [C0402]
C10  10uF  Voltage: 25V  Dielectric: X5R  [C1206]
C11  100nF  Voltage: 25V  Dielectric: X5R  [C0402]
C12  22pF  Voltage: 50V  Dielectric: C0G  [C0402]
C13  22uF  Voltage: 10V  Dielectric: X5R  [C0805]
C14  100nF  Voltage: 10V  Dielectric: X5R  [C0402]
C19  100nF  Voltage: 10V  Dielectric: X5R  [C0402]
C20  22uF  Voltage: 10V  Dielectric: X5R  [C0805]
C21  22uF  Voltage: 10V  Dielectric: X5R  [C0805]
C22  22uF  Voltage: 10V  Dielectric: X5R  [C0805]
C27  10uF  Voltage: 25V  Dielectric: X5R  [C1206]
C28  100nF  Voltage: 25V  Dielectric: X5R  [C0402]
C29  10uF  Voltage: 10V  Dielectric: X5R  [C0603]
C30  100nF  Voltage: 16V  Dielectric: X5R  [C0402]
C31  10nF  Voltage: 10V  Dielectric: X7R  [C0402]
C32  10nF  Voltage: 10V  Dielectric: X7R  [C0402]
C33  10nF  Voltage: 10V  Dielectric: X7R  [C0402]
C34  10nF  Voltage: 10V  Dielectric: X7R  [C0402]
D5  BTR04G02  [ESD0402_1xD5]
D6  BTR04G02  [ESD0402_1xD5]
D7  BTR04G02  [ESD0402_1xD5]
D8  BTR04G02  [ESD0402_1xD5]
J6  PCIEX1_36PIN_DIP  [PCIEX1_36PIN_DIP]
J7  SATA30_7P_V_DIP  [SMD_SATA_7P_50_180]
L1  4.7uH  DC Resistor: 0.02ohm  Isat: 4.97A  [IND-5020]
R14  100K  [R0402]
R15  232K  Tolerance: 1%  [R0402]
R17  24K  [R0402]
R18  49.9K  Tolerance: 1%  [R0402]
R20  NC  [R0402]
R21  22R  [R0402]
R22  22R  [R0402]
R23  22R  [R0402]
R24  22R  [R0402]
R25  0R  [R0402]
R26  NC  [R0402]
R28  0R  [R0402]
R206  NC  [R0402]
R207  0R  [R0402]
U7  SY8113B  [SOT_23_6]
U8  CH482D  [CH482X]

### Nets
GND: C10.2 C11.2 C13.2 C14.2 C19.2 C20.2 C21.2 C22.2 C27.2 C28.2 C29.2 C30.2 D5.1 D6.1 D7.1 D8.1 J6.A4(GND_A4) J6.A12(GND_A12) J6.A15(GND_A15) J6.A18(GND_A18) J6.B4(GND_B4) J6.B7(GND_B7) J6.B13(GND_B13) J6.B16(GND_B16) J6.B18(GND_B18) J7.1(GND1) J7.4(GND2) J7.7(GND3) J7.8 J7.9 R17.2 R18.2 R20.2 R25.1 R26.2 R206.1 U7.2(GND) U8.4(GND1) U8.10(GND3) U8.19(GND2) U8.21(PAD)
VCC3V3_PCIE: C12.1 C13.1 C14.1 C20.1 C21.1 C22.1 J6.A9(+3.3V_A9) J6.A10(+3.3V_A10) J6.B8(+3.3V_B8) J6.B10(3.3VAUX) L1.2 R15.1 R21.2 R22.2 R23.2 R24.1
VCC3V3_SYS: C29.1 C30.1 R207.1 U8.9(VDD2) U8.20(VDD)
VCC12V: C10.1 C11.1 C27.1 C28.1 J6.A2(+12V_A2) J6.A3(+12V_A3) J6.B1(+12V_B1) J6.B2(+12V_B2) J6.B3(+12V_B3) R14.1 U7.5(VIN)
I2S1_MCLK_M1: R28.2 ; off-sheet I2S1_MCLK_M1
PCIE20_CLKREQn_M2: J6.B12(nCLKREQ_B12) ; off-sheet PCIE20_CLKREQn_M2
PCIE20_REFCLKN: J6.A14(REFCLK_N) ; off-sheet PCIE20_REFCLKN
PCIE20_REFCLKP: J6.A13(REFCLK_P) ; off-sheet PCIE20_REFCLKP
PCIE20_RXN: U8.7(SSB-N) ; off-sheet PCIE20_RXN
PCIE20_RXN_1: J6.A17(HSIn(0)) U8.15(SSB0-N) ; off-sheet PCIE20_RXN_1
PCIE20_RXP: U8.6(SSB-P) ; off-sheet PCIE20_RXP
PCIE20_RXP_1: J6.A16(HSIp(0)) U8.16(SSB0-P) ; off-sheet PCIE20_RXP_1
PCIE20_TXN: U8.3(SSA-N) ; off-sheet PCIE20_TXN
PCIE20_TXN_1: J6.B15(HSOn(0)) U8.17(SSA0-N) ; off-sheet PCIE20_TXN_1
PCIE20_TXP: U8.2(SSA-P) ; off-sheet PCIE20_TXP
PCIE20_TXP_1: J6.B14(HSOp(0)) U8.18(SSA0-P) ; off-sheet PCIE20_TXP_1
PCIE20_WAKEn: J6.B11(~{WAKE}#) ; off-sheet PCIE20_WAKEn
PCIE_EN_L: R26.1 R28.1 U8.8(SEL) ; off-sheet PCIE_EN_L
Pcie_nRST: J6.A11(~{PERST}#) ; off-sheet Pcie_nRST
SATA1_RXN: C33.1 U8.11(SSB1-N) ; off-sheet SATA1_RXN
SATA1_RXP: C34.1 U8.12(SSB1-P) ; off-sheet SATA1_RXP
SATA1_TXN: C32.1 U8.13(SSA1-N) ; off-sheet SATA1_TXN
SATA1_TXP: C31.1 U8.14(SSA1-P) ; off-sheet SATA1_TXP
NetC9_1: C9.1 U7.1(BS)
NetC9_2: C9.2 L1.1 U7.6(LX)
NetC12_2: C12.2 R15.2 R18.1 U7.3(FB/OUT)
NetC19_1: C19.1 R14.2 R17.1 U7.4(EN)
NetC31_2: C31.2 D8.2 J7.2(TXP)
NetC32_2: C32.2 D7.2 J7.3(TXN)
NetC33_2: C33.2 D6.2 J7.5(RXN)
NetC34_2: C34.2 D5.2 J7.6(RXP)
NetJ6_A1: J6.A1(~{PRSNT1}#) R20.1
NetJ6_A5: J6.A5(JTAG_TCK) R21.1
NetJ6_A6: J6.A6(JTAG_TDI) R22.1
NetJ6_A8: J6.A8(JTAG_TMS) R23.1
NetJ6_B9: J6.B9(JTAG_TRST) R24.2
NetR25_2: R25.2 U8.1(EN)
NetR206_2: R206.2 R207.2 U8.5(NC1)

Not connected (* = marked no-connect by the designer): J6 A7(JTAG_TDO)* B5(SMCLK)* B6(SMDAT)* B17(PRSNT2#_1)* C1(HOLE_1)* C2(HOLE_2)*

### Notes on the sheet
- Default 3.39V
- FB=0.6V
- (near R25) OE (0=EN)
- SATA3.0 Port2
- SEL  (0=SW0,1=SW1)
- (in symbol PCIE_4X_CON_1) B; x1
- (in symbol radxa_1010) Title:; Size; REV; Page Name:; Date:; Sheet; of

### Library data of the parts
C9 = CAP NP_0: cap,100.00nF,+/-10%,25V,X5R,C0402; Part Reference: C9; Manufacturer: TDK; Number: 37; RK PN: C1005X5R1E104K050BC; Priority: A; Tolerance: 10%; C_Voltage: 6.3V; PCB Footprint: C0402; Value: 100nF; Part Type: C0402; Manufacturer PN: C1005X5R1E104K050BC; Created by: JJJ
C10 = CAP NP_0: cap,10.00uF,+/-10%,25V,X5R,C1206; Part Reference: C10; Manufacturer: TDK; RK PN: C3216X5R1E106K085AC; Priority: A; C_Voltage: 6.3V; Tolerance: 10%; PCB Footprint: C1206; Value: 10uF; Part Type: C1206; Manufacturer PN: C3216X5R1E106K085AC; Created by: JJJ
C11 = CAP NP_0: cap,100.00nF,+/-10%,25V,X5R,C0402; Part Reference: C11; Manufacturer PN: C1005X5R1E104K050BC; Manufacturer: TDK; Tolerance: 10%; Priority: A; PCB Footprint: C0402; Value: 100nF; Created by: JJJ; Part Type: C0402; RK PN: C1005X5R1E104K050BC
C12 = CAP NP_0: cap,22.00pF,+/-5%,50V,C0G,C0402; Part Reference: C12; Manufacturer: TDK; RK PN: C1005C0G1H220J050BA; Priority: A; Tolerance: 5%; PCB Footprint: C0402; Value: 22pF; Part Type: C0402; Manufacturer PN: C1005C0G1H220J050BA; Created by: JJJ
C13 = CAP NP_0: cap,22.00uF,+/-10%,10V,X5R,C0805; Part Reference: C13; Manufacturer: TDK; RK PN: C2012X5R1A226K125AB; Priority: A; C_Voltage: 6.3V; Tolerance: 10%; PCB Footprint: C0805; Value: 22uF; Part Type: C0805; Manufacturer PN: C2012X5R1A226K125AB; Created by: JJJ
C14 = CAP NP_0: cap,100.00nF,+/-10%,10V,X5R,C0402; Part Reference: C14; Manufacturer: TDK; Number: 37; RK PN: C1005X5R1A104K050BA; Priority: A; Tolerance: 10%; C_Voltage: 6.3V; PCB Footprint: C0402; Value: 100nF; Part Type: C0402; Manufacturer PN: C1005X5R1A104K050BA; Created by: JJJ
C19 = CAP NP_0: cap,100.00nF,+/-10%,10V,X5R,C0402; Part Reference: C19; Manufacturer PN: C1005X5R1A104K050BA; Manufacturer: TDK; C_Voltage: 6.3V; Tolerance: 10%; Priority: A; Number: 37; PCB Footprint: C0402; Value: 100nF; Created by: JJJ; Part Type: C0402; RK PN: C1005X5R1A104K050BA
C20 = CAP NP_0: cap,22.00uF,+/-10%,10V,X5R,C0805; Part Reference: C20; Manufacturer PN: C2012X5R1A226K125AB; Manufacturer: TDK; Tolerance: 10%; C_Voltage: 6.3V; Priority: A; PCB Footprint: C0805; Value: 22uF; Created by: JJJ; Part Type: C0805; RK PN: C2012X5R1A226K125AB
C21 = CAP NP_0: cap,22.00uF,+/-10%,10V,X5R,C0805; Part Reference: C21; Manufacturer: TDK; RK PN: C2012X5R1A226K125AB; Priority: A; C_Voltage: 6.3V; Tolerance: 10%; PCB Footprint: C0805; Value: 22uF; Part Type: C0805; Manufacturer PN: C2012X5R1A226K125AB; Created by: JJJ
C22 = CAP NP_0: cap,22.00uF,+/-10%,10V,X5R,C0805; Part Reference: C22; Manufacturer: TDK; RK PN: C2012X5R1A226K125AB; Priority: A; C_Voltage: 6.3V; Tolerance: 10%; PCB Footprint: C0805; Value: 22uF; Part Type: C0805; Manufacturer PN: C2012X5R1A226K125AB; Created by: JJJ
C27 = CAP NP_0: cap,10.00uF,+/-10%,25V,X5R,C1206; Part Reference: C27; Manufacturer PN: C3216X5R1E106K085AC; Manufacturer: TDK; Tolerance: 10%; C_Voltage: 6.3V; Priority: A; PCB Footprint: C1206; Value: 10uF; Created by: JJJ; Part Type: C1206; RK PN: C3216X5R1E106K085AC
C28 = CAP NP_0: cap,100.00nF,+/-10%,25V,X5R,C0402; Part Reference: C28; Manufacturer: TDK; RK PN: C1005X5R1E104K050BC; Priority: A; Tolerance: 10%; PCB Footprint: C0402; Value: 100nF; Part Type: C0402; Manufacturer PN: C1005X5R1E104K050BC; Created by: JJJ
C29 = CAP NP_0: cap,22.00uF,+/-10%,10V,X5R,C0805; Part Reference: C29; Manufacturer: TDK; RK PN: C2012X5R1A226K125AB; Priority: A; Tolerance: 10%; PCB Footprint: C0603; Value: 10uF; Part Type: C0805; Manufacturer PN: C2012X5R1A226K125AB; Created by: JJJ
C30 = CAP NP_0: cap,100.00nF,+/-10%,16V,X5R,C0402; Part Reference: C30; Manufacturer: TDK; RK PN: C1005X5R1C104K050BA; Priority: A; Tolerance: 10%; PCB Footprint: C0402; Value: 100nF; Part Type: C0402; Manufacturer PN: C1005X5R1C104K050BA; Created by: JJJ
C31 = CAP NP_0: cap,10.00nF,+/-10%,10V,X7R,C0201; Part Reference: C31; Manufacturer PN: C0603X7R1A103K030BA; Manufacturer: TDK; Tolerance: 10%; Priority: A; PCB Footprint: C0402; Value: 10nF; Created by: JJJ; Part Type: C0201; RK PN: C0603X7R1A103K030BA
C32 = CAP NP_0: cap,10.00nF,+/-10%,10V,X7R,C0201; Part Reference: C32; Manufacturer PN: C0603X7R1A103K030BA; Manufacturer: TDK; Tolerance: 10%; Priority: A; PCB Footprint: C0402; Value: 10nF; Created by: JJJ; Part Type: C0201; RK PN: C0603X7R1A103K030BA
C33 = CAP NP_0: cap,10.00nF,+/-10%,10V,X7R,C0201; Part Reference: C33; Manufacturer PN: C0603X7R1A103K030BA; Manufacturer: TDK; Tolerance: 10%; Priority: A; PCB Footprint: C0402; Value: 10nF; Created by: JJJ; Part Type: C0201; RK PN: C0603X7R1A103K030BA
C34 = CAP NP_0: cap,10.00nF,+/-10%,10V,X7R,C0201; Part Reference: C34; Manufacturer PN: C0603X7R1A103K030BA; Manufacturer: TDK; Tolerance: 10%; Priority: A; PCB Footprint: C0402; Value: 10nF; Created by: JJJ; Part Type: C0201; RK PN: C0603X7R1A103K030BA
D5 = DIODE BI_DIR TRIG_0: 1-Line, Bi-directional, Transient Voltage Suppressors.17.5pF.; Part Reference: D5; Manufacturer: WillSemi(韦尔半导体); RK PN: ESD5451N; Priority: A; OPTION: DNP; PCB Footprint: ESD0402_1xD5; Value: BTR04G02; Part Type: ESD_TVS; Manufacturer PN: ESD5451N; Created by: JJJ
D6 = DIODE BI_DIR TRIG_0: 1-Line, Bi-directional, Transient Voltage Suppressors.17.5pF.; Part Reference: D6; Manufacturer: WillSemi(韦尔半导体); RK PN: ESD5451N; Priority: A; OPTION: DNP; PCB Footprint: ESD0402_1xD5; Value: BTR04G02; Part Type: ESD_TVS; Manufacturer PN: ESD5451N; Created by: JJJ
D7 = DIODE BI_DIR TRIG_0: 1-Line, Bi-directional, Transient Voltage Suppressors.17.5pF.; Part Reference: D7; Manufacturer PN: ESD5451N; Manufacturer: WillSemi(韦尔半导体); OPTION: DNP; Priority: A; PCB Footprint: ESD0402_1xD5; Value: BTR04G02; Created by: JJJ; Part Type: ESD_TVS; RK PN: ESD5451N
D8 = DIODE BI_DIR TRIG_0: 1-Line, Bi-directional, Transient Voltage Suppressors.17.5pF.; Part Reference: D8; Manufacturer PN: ESD5451N; Manufacturer: WillSemi(韦尔半导体); OPTION: DNP; Priority: A; PCB Footprint: ESD0402_1xD5; Value: BTR04G02; Created by: JJJ; Part Type: ESD_TVS; RK PN: ESD5451N
J6 = PCIE_4X_CON_1: PCIE 4X座子，立式，SMT；; Part Reference: J6; Manufacturer Part Number: PCIE64_SMT; Priority: A; PCB Footprint: PCIEX1_36PIN_DIP; Value: PCIEX1_36PIN_DIP; Part Type: PCIE; RK PN: PCIE64_SMT
J7 = SATA_DIP_1: Part Reference: J7; Value: SATA30_7P_V_DIP; PCB Footprint: SMD_SATA_7P_50_180
L1 = INDUCTORS OF FERRITE: Power Inductor,4.7uH,0.2,IND_606045; Part Reference: L1; Manufacturer PN: SWPA6045S4R7MT; Manufacturer: sunlord; Resonace frequency: 24M; Irms: 3.3A; Tolerance: 20%; Priority: A; PCB Footprint: IND-5020; Value: 4.7uH; Created by: YWQ; Part Type: POWER_IND; RK PN: SWPA6045S4R7MT
R14 = RESISTOR_0: 通用厚膜电阻,100K,+/-5%,R0402,1/16W.; Part Reference: R14; Manufacturer PN: RC0402JR-07100KL; Manufacturer: YAGEO; Wattage: 1/16W; Tolerance: 5%; Priority: A; Value: 100K; Created by: YTL; Part Type: 通用厚膜电阻; RK PN: RC0402JR-07100KL; PCB Footprint: R0402
R15 = RESISTOR_0: 通用厚膜电阻,232K,+/-1%,R0402,1/16W.; Part Reference: R15; Manufacturer: YAGEO; RK PN: RC0402FR-07232KL; Priority: A; Wattage: 1/16W; Value: 232K; Part Type: 通用厚膜电阻; Manufacturer PN: RC0402FR-07232KL; Created by: YTL; PCB Footprint: R0402
R17 = RESISTOR_0: 通用厚膜电阻,24K,+/-5%,R0402,1/16W.; Part Reference: R17; Manufacturer: YAGEO; RK PN: RC0402JR-0724KL; Priority: A; Tolerance: 5%; Wattage: 1/16W; Value: 24K; Part Type: 通用厚膜电阻; Manufacturer PN: RC0402JR-0724KL; Created by: YTL; PCB Footprint: R0402
R18 = RESISTOR_0: 通用厚膜电阻,49K9,+/-1%,R0402,1/16W.; Part Reference: R18; Manufacturer PN: RC0402FR-0749K9L; Manufacturer: YAGEO; Wattage: 1/16W; Priority: A; Value: 49.9K; Created by: YTL; Part Type: 通用厚膜电阻; RK PN: RC0402FR-0749K9L; PCB Footprint: R0402
R20 = RESISTOR_0: 通用厚膜电阻,0R,+/-5%,R0402,1/16W.; Part Reference: R20; Manufacturer: YAGEO; RK PN: RC0402JR-070RL; Priority: A; Tolerance: 5%; Wattage: 1/16W; Value: NC; Part Type: 通用厚膜电阻; Manufacturer PN: RC0402JR-070RL; Created by: YTL; PCB Footprint: R0402
R21 = RESISTOR_0: 通用厚膜电阻,10K,+/-5%,R0402,1/16W.; Part Reference: R21; Manufacturer PN: RC0402JR-0710KL; Manufacturer: YAGEO; Wattage: 1/16W; Tolerance: 5%; Priority: A; Value: 22R; Created by: YTL; Part Type: 通用厚膜电阻; RK PN: RC0402JR-0710KL; PCB Footprint: R0402
R22 = RESISTOR_0: 通用厚膜电阻,10K,+/-5%,R0402,1/16W.; Part Reference: R22; Manufacturer PN: RC0402JR-0710KL; Manufacturer: YAGEO; Wattage: 1/16W; Tolerance: 5%; Priority: A; Value: 22R; Created by: YTL; Part Type: 通用厚膜电阻; RK PN: RC0402JR-0710KL; PCB Footprint: R0402
R23 = RESISTOR_0: 通用厚膜电阻,10K,+/-5%,R0402,1/16W.; Part Reference: R23; Manufacturer: YAGEO; RK PN: RC0402JR-0710KL; Priority: A; Tolerance: 5%; Wattage: 1/16W; Value: 22R; Part Type: 通用厚膜电阻; Manufacturer PN: RC0402JR-0710KL; Created by: YTL; PCB Footprint: R0402
R24 = RESISTOR_0: 通用厚膜电阻,10K,+/-5%,R0402,1/16W.; Part Reference: R24; Manufacturer PN: RC0402JR-0710KL; Manufacturer: YAGEO; Wattage: 1/16W; Tolerance: 5%; Priority: A; Value: 22R; Created by: YTL; Part Type: 通用厚膜电阻; RK PN: RC0402JR-0710KL; PCB Footprint: R0402
R25 = RESISTOR_0: 通用厚膜电阻,0R,+/-5%,R0402,1/16W.; Part Reference: R25; Manufacturer PN: RC0402JR-070RL; Manufacturer: YAGEO; Wattage: 1/16W; Tolerance: 5%; Priority: A; Value: 0R; Created by: YTL; Part Type: 通用厚膜电阻; RK PN: RC0402JR-070RL; PCB Footprint: R0402
R26 = RESISTOR_0: 通用厚膜电阻,4K7,+/-5%,R0402,1/16W.; Part Reference: R26; Manufacturer: YAGEO; RK PN: RC0402JR-074K7L; Priority: A; Tolerance: 5%; Wattage: 1/16W; Value: NC; Part Type: 通用厚膜电阻; Manufacturer PN: RC0402JR-074K7L; Created by: YTL; PCB Footprint: R0402
R28 = RESISTOR_0: 通用厚膜电阻,100R,+/-5%,R0402,1/16W.; Part Reference: R28; Manufacturer PN: RC0402JR-07100RL; Manufacturer: YAGEO; Wattage: 1/16W; Tolerance: 5%; Priority: A; Value: 0R; Created by: YTL; Part Type: 通用厚膜电阻; RK PN: RC0402JR-07100RL; PCB Footprint: R0402
R206 = RESISTOR_0: 通用厚膜电阻,0R,+/-5%,R0402,1/16W.; Part Reference: R206; Manufacturer: YAGEO; RK PN: RC0402JR-070RL; Priority: A; Tolerance: 5%; Wattage: 1/16W; Value: NC; Part Type: 通用厚膜电阻; Manufacturer PN: RC0402JR-070RL; Created by: YTL; PCB Footprint: R0402
R207 = RESISTOR_0: 通用厚膜电阻,0R,+/-5%,R0402,1/16W.; Part Reference: R207; Manufacturer PN: RC0402JR-070RL; Manufacturer: YAGEO; Wattage: 1/16W; Tolerance: 5%; Priority: A; Value: 0R; Created by: YTL; Part Type: 通用厚膜电阻; RK PN: RC0402JR-070RL; PCB Footprint: R0402
U7 = DCDC_SY8113: Part Reference: U7; Manufacturer: Silergy（矽力杰）; Priority: A; PCB Footprint: SOT_23_6; Value: SY8113B; Created by: JJJ; Manufacturer PN: SY8113B; Part Type: DCDC; RK PN: SY8113B
U8 = CH482X: Part Reference: U8; PCB Footprint: QFN20-2D5X4D5; Value: CH482D
*#6 = radxa_1010: Page Create Date: March  8, 1995; Page Size: =PageSize; Page Modify Date: =ModifiedDate

## Sheet 08.AUDIO.SchDoc: CM3 IO
size 246 x 182 mm; Page Create Date: March  8, 1995; Page Number: 08; Page Size: A; Comment: radxa_1010; Page Count: 20; RevCode: 1.36; Doc: AUDIO; DsnPath: D:\WMS\黄工\[RC119]CM3_IO_V1.36\对外资料\radxa_cm3_io_board_v1360.DSN; SchematicName: CM3_IO V1.36; PageName: 08.AUDIO; PageSize: A; TopSchematic: True
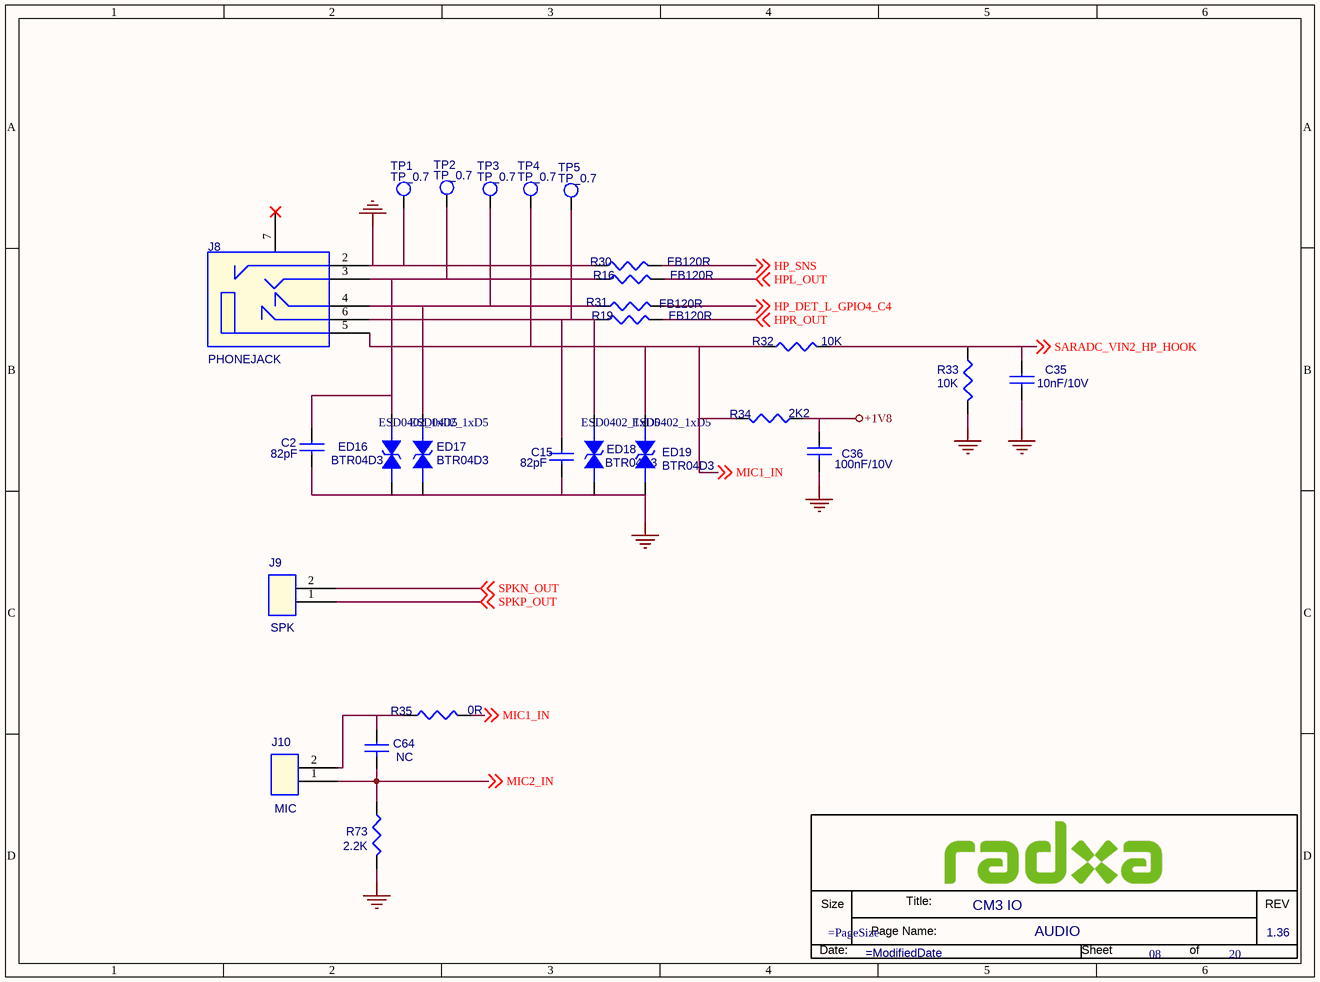
[diagram p6: 08.AUDIO.SchDoc]

### Parts
(Parts that share a designator on the sheet are numbered #1, #2 ... from top to bottom, then left to right.)
*#7  Doc: AUDIO  RevCode: 1.36  Title: CM3 IO  Page Number: 08  Page Count: 20  (hidden comment: radxa_1010)  (graphical)
C2  82pF  [C0402]
C15  82pF  [C0402]
C35  10nF/10V  [C0402]
C36  100nF/10V  [C0402]
C64  NC  [C0402]
ED16  BTR04D3  [ESD0402_1xD5]
ED17  BTR04D3  [ESD0402_1xD5]
ED18  BTR04D3  [ESD0402_1xD5]
ED19  BTR04D3  [ESD0402_1xD5]
J8  PHONEJACK  [PJ-327A]
J9  SPK  [DIP2PIN-2P54MM]
J10  MIC  [DIP2PIN-2P54MM]
R16  FB120R  [R0402]
R19  FB120R  [R0402]
R30  FB120R  [R0402]
R31  FB120R  [R0402]
R32  10K  [R0402]
R33  10K  [R0402]
R34  2K2  [R0402]
R35  0R  [R0402]
R73  2.2K  [R0402]
TP1  TP_0.7  [TEST]
TP2  TP_0.7  [TEST]
TP3  TP_0.7  [TEST]
TP4  TP_0.7  [TEST]
TP5  TP_0.7  [TEST]

### Nets
+1V8: C36.1 R34.2
GND: C2.2 C15.2 C35.2 C36.2 ED16.2 ED17.2 ED18.2 ED19.2 J8.2(DH) R30.1 R33.1 R73.1 TP1.1
HP_DET_L_GPIO4_C4: R31.2 ; off-sheet HP_DET_L_GPIO4_C4
HP_SNS: R30.2 ; off-sheet HP_SNS
HPL_OUT: R16.2 ; off-sheet HPL_OUT
HPR_OUT: R19.2 ; off-sheet HPR_OUT
MIC1_IN: ED19.1 J8.5(D) R32.2 R34.1 R35.2 TP4.1 ; off-sheet MIC1_IN
MIC2_IN: C64.2 J10.1 R73.2 ; off-sheet MIC2_IN
SARADC_VIN2_HP_HOOK: C35.1 R32.1 R33.2 ; off-sheet SARADC_VIN2_HP_HOOK
SPKN_OUT: J9.2 ; off-sheet SPKN_OUT
SPKP_OUT: J9.1 ; off-sheet SPKP_OUT
NetC2_1: C2.1 ED16.1 J8.3(R) R16.1 TP2.1
NetC15_1: C15.1 ED18.1 J8.6(HP) R19.1 TP5.1
NetC64_1: C64.1 J10.2 R35.1
NetED17_1: ED17.1 J8.4(L) R31.1 TP3.1

Not connected (* = marked no-connect by the designer): J8 7(NC2)*

### Notes on the sheet
- (in symbol radxa_1010) Size; Title:; REV; Page Name:; Date:; Sheet; of

### Library data of the parts
C2 = CAP: RoHS CHIP CAP 0.1uF +10/-10% X7R; Part Reference: C2; Value: 82pF; PCB Footprint: C0402
C15 = CAP: RoHS CHIP CAP 0.1uF +10/-10% X7R; Part Reference: C15; Value: 82pF; PCB Footprint: C0402
C35 = CAP: RoHS CHIP CAP 0.01uF +10/-10% X7R; Part Reference: C35; Value: 10nF/10V; PCB Footprint: C0402
C36 = CAP: RoHS CHIP CAP 0.1uF +10/-10% X7R; Part Reference: C36; Value: 100nF/10V; PCB Footprint: C0402
C64 = CAP: RoHS CHIP CAP 0.01uF +10/-10% X7R; Part Reference: C64; Value: NC; PCB Footprint: C0402
ED16 = DIODE BI_DIR TRIG_0: 1-Line, Bi-directional, Transient Voltage Suppressors.17.5pF.; Part Reference: ED16; Manufacturer: WillSemi(韦尔半导体); RK PN: ESD5451N; Priority: A; PCB Footprint: ESD0402_1xD5; Value: BTR04D3; Part Type: ESD_TVS; Manufacturer PN: ESD5451N; Created by: JJJ
ED17 = DIODE BI_DIR TRIG_0: 1-Line, Bi-directional, Transient Voltage Suppressors.17.5pF.; Part Reference: ED17; Manufacturer PN: ESD5451N; Manufacturer: WillSemi(韦尔半导体); Priority: A; PCB Footprint: ESD0402_1xD5; Value: BTR04D3; Created by: JJJ; Part Type: ESD_TVS; RK PN: ESD5451N
ED18 = DIODE BI_DIR TRIG_0: 1-Line, Bi-directional, Transient Voltage Suppressors.17.5pF.; Part Reference: ED18; Manufacturer PN: ESD5451N; Manufacturer: WillSemi(韦尔半导体); Priority: A; PCB Footprint: ESD0402_1xD5; Value: BTR04D3; Created by: JJJ; Part Type: ESD_TVS; RK PN: ESD5451N
ED19 = DIODE BI_DIR TRIG_0: 1-Line, Bi-directional, Transient Voltage Suppressors.17.5pF.; Part Reference: ED19; Manufacturer: WillSemi(韦尔半导体); RK PN: ESD5451N; Priority: A; PCB Footprint: ESD0402_1xD5; Value: BTR04D3; Part Type: ESD_TVS; Manufacturer PN: ESD5451N; Created by: JJJ
J8 = PHONEJACK STEREO SW_0: 耳插; Part Reference: J8; BOM_VALUE: 0; BOM_TYPE: 60; Value: PHONEJACK; PCB Footprint: PJ-327A
J9 = CON2: Part Reference: J9; Value: SPK; PCB Footprint: DIP2PIN-2P54MM
J10 = CON2: Part Reference: J10; Value: MIC; PCB Footprint: DIP2PIN-2P54MM
R16 = RESISTOR_0: 通用厚膜电阻,0R,+/-5%,R0402,1/16W.; Part Reference: R16; Manufacturer: YAGEO; RK PN: RC0402JR-070RL; Priority: A; Tolerance: 5%; Wattage: 1/16W; Value: FB120R; Part Type: 通用厚膜电阻; Manufacturer PN: RC0402JR-070RL; Created by: YTL; PCB Footprint: R0402
R19 = RESISTOR_0: 通用厚膜电阻,0R,+/-5%,R0402,1/16W.; Part Reference: R19; Manufacturer PN: RC0402JR-070RL; Manufacturer: YAGEO; Wattage: 1/16W; Tolerance: 5%; Priority: A; Value: FB120R; Created by: YTL; Part Type: 通用厚膜电阻; RK PN: RC0402JR-070RL; PCB Footprint: R0402
R30 = RESISTOR_0: 通用厚膜电阻,0R,+/-5%,R0402,1/16W.; Part Reference: R30; Manufacturer: YAGEO; RK PN: RC0402JR-070RL; Priority: A; Tolerance: 5%; Wattage: 1/16W; Value: FB120R; Part Type: 通用厚膜电阻; Manufacturer PN: RC0402JR-070RL; Created by: YTL; PCB Footprint: R0402
R31 = RESISTOR_0: 通用厚膜电阻,0R,+/-5%,R0402,1/16W.; Part Reference: R31; Manufacturer PN: RC0402JR-070RL; Manufacturer: YAGEO; Wattage: 1/16W; Tolerance: 5%; Priority: A; Value: FB120R; Created by: YTL; Part Type: 通用厚膜电阻; RK PN: RC0402JR-070RL; PCB Footprint: R0402
R32 = RESISTOR: ROHS CHIP RES 0R 1/16W 5%; Part Reference: R32; Value: 10K; PCB Footprint: R0402
R33 = RESISTOR: ROHS CHIP RES 0R 1/16W 5%; Part Reference: R33; Value: 10K; PCB Footprint: R0402
R34 = RESISTOR: ROHS CHIP RES 2K2 1/16W 5%; Part Reference: R34; Value: 2K2; PCB Footprint: R0402
R35 = RESISTOR_0: 通用厚膜电阻,0R,+/-5%,R0402,1/16W.; Part Reference: R35; Manufacturer: YAGEO; RK PN: RC0402JR-070RL; Priority: A; Tolerance: 5%; Wattage: 1/16W; Value: 0R; Part Type: 通用厚膜电阻; Manufacturer PN: RC0402JR-070RL; Created by: YTL; PCB Footprint: R0402
R73 = RESISTOR: ROHS CHIP RES 0R 1/16W 5%; Part Reference: R73; Value: 2.2K; PCB Footprint: R0402
TP1 = TP: Test Point 0.7mm; Part Reference: TP1; PCB Footprint: TP_0R70; RK PN: TESTPOINT_0R7; Priority: A; Value: TP_0.7; Part Type: TP; Created by: JJJ
TP2 = TP: Test Point 0.7mm; Part Reference: TP2; PCB Footprint: TP_0R70; Priority: A; RK PN: TESTPOINT_0R7; Value: TP_0.7; Created by: JJJ; Part Type: TP
TP3 = TP: Test Point 0.7mm; Part Reference: TP3; PCB Footprint: TP_0R70; RK PN: TESTPOINT_0R7; Priority: A; Value: TP_0.7; Part Type: TP; Created by: JJJ
TP4 = TP: Test Point 0.7mm; Part Reference: TP4; PCB Footprint: TP_0R70; Priority: A; RK PN: TESTPOINT_0R7; Value: TP_0.7; Created by: JJJ; Part Type: TP
TP5 = TP: Test Point 0.7mm; Part Reference: TP5; PCB Footprint: TP_0R70; RK PN: TESTPOINT_0R7; Priority: A; Value: TP_0.7; Part Type: TP; Created by: JJJ
*#7 = radxa_1010: Page Create Date: March  8, 1995; Page Size: =PageSize; Page Modify Date: =ModifiedDate